# EAGLE schematic STM32 output card (EAGLE 9.5.1)
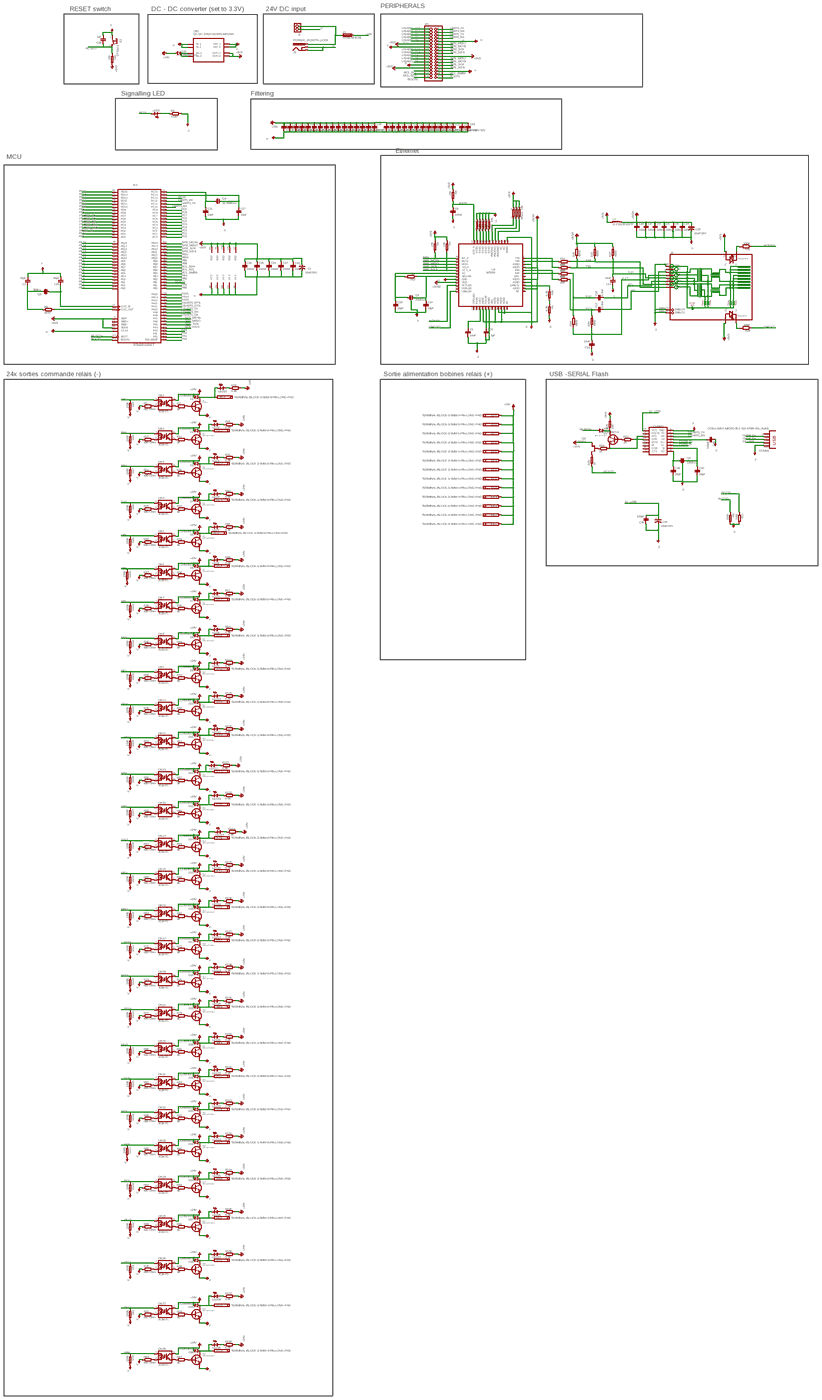
[diagram p0: schematic, sheet 1, overview]
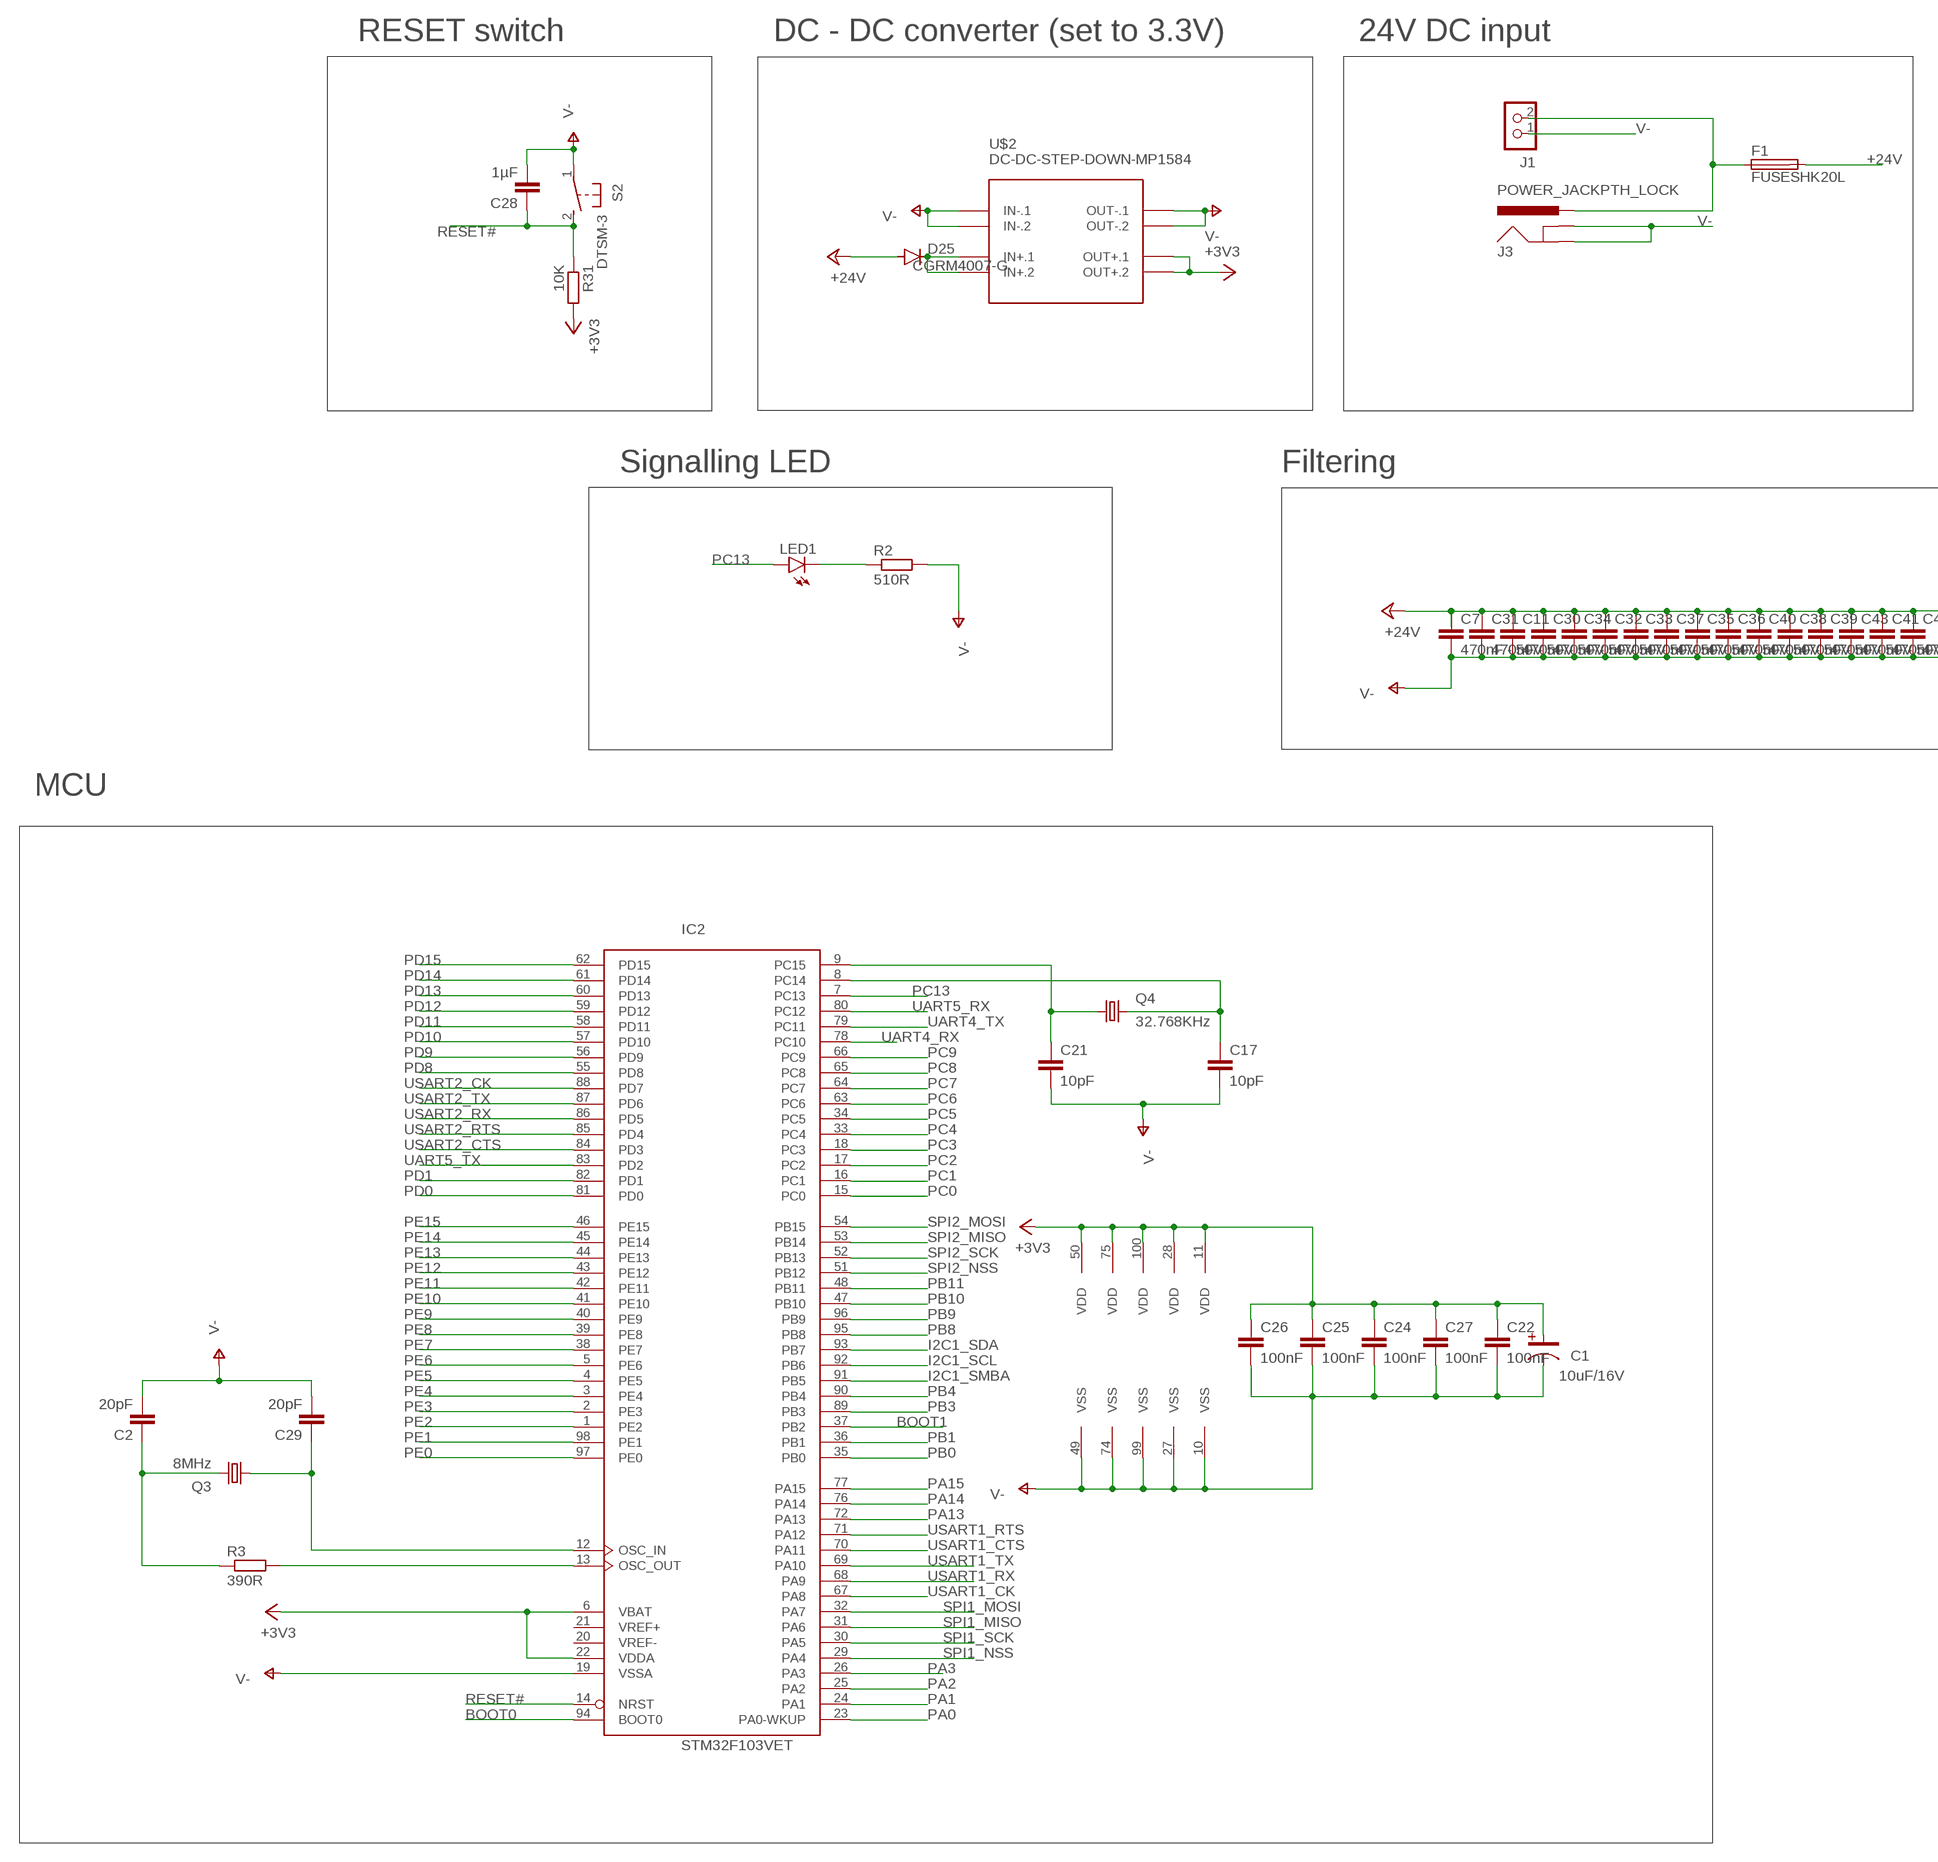
[diagram p1: schematic, sheet 1, part 1 of 6]
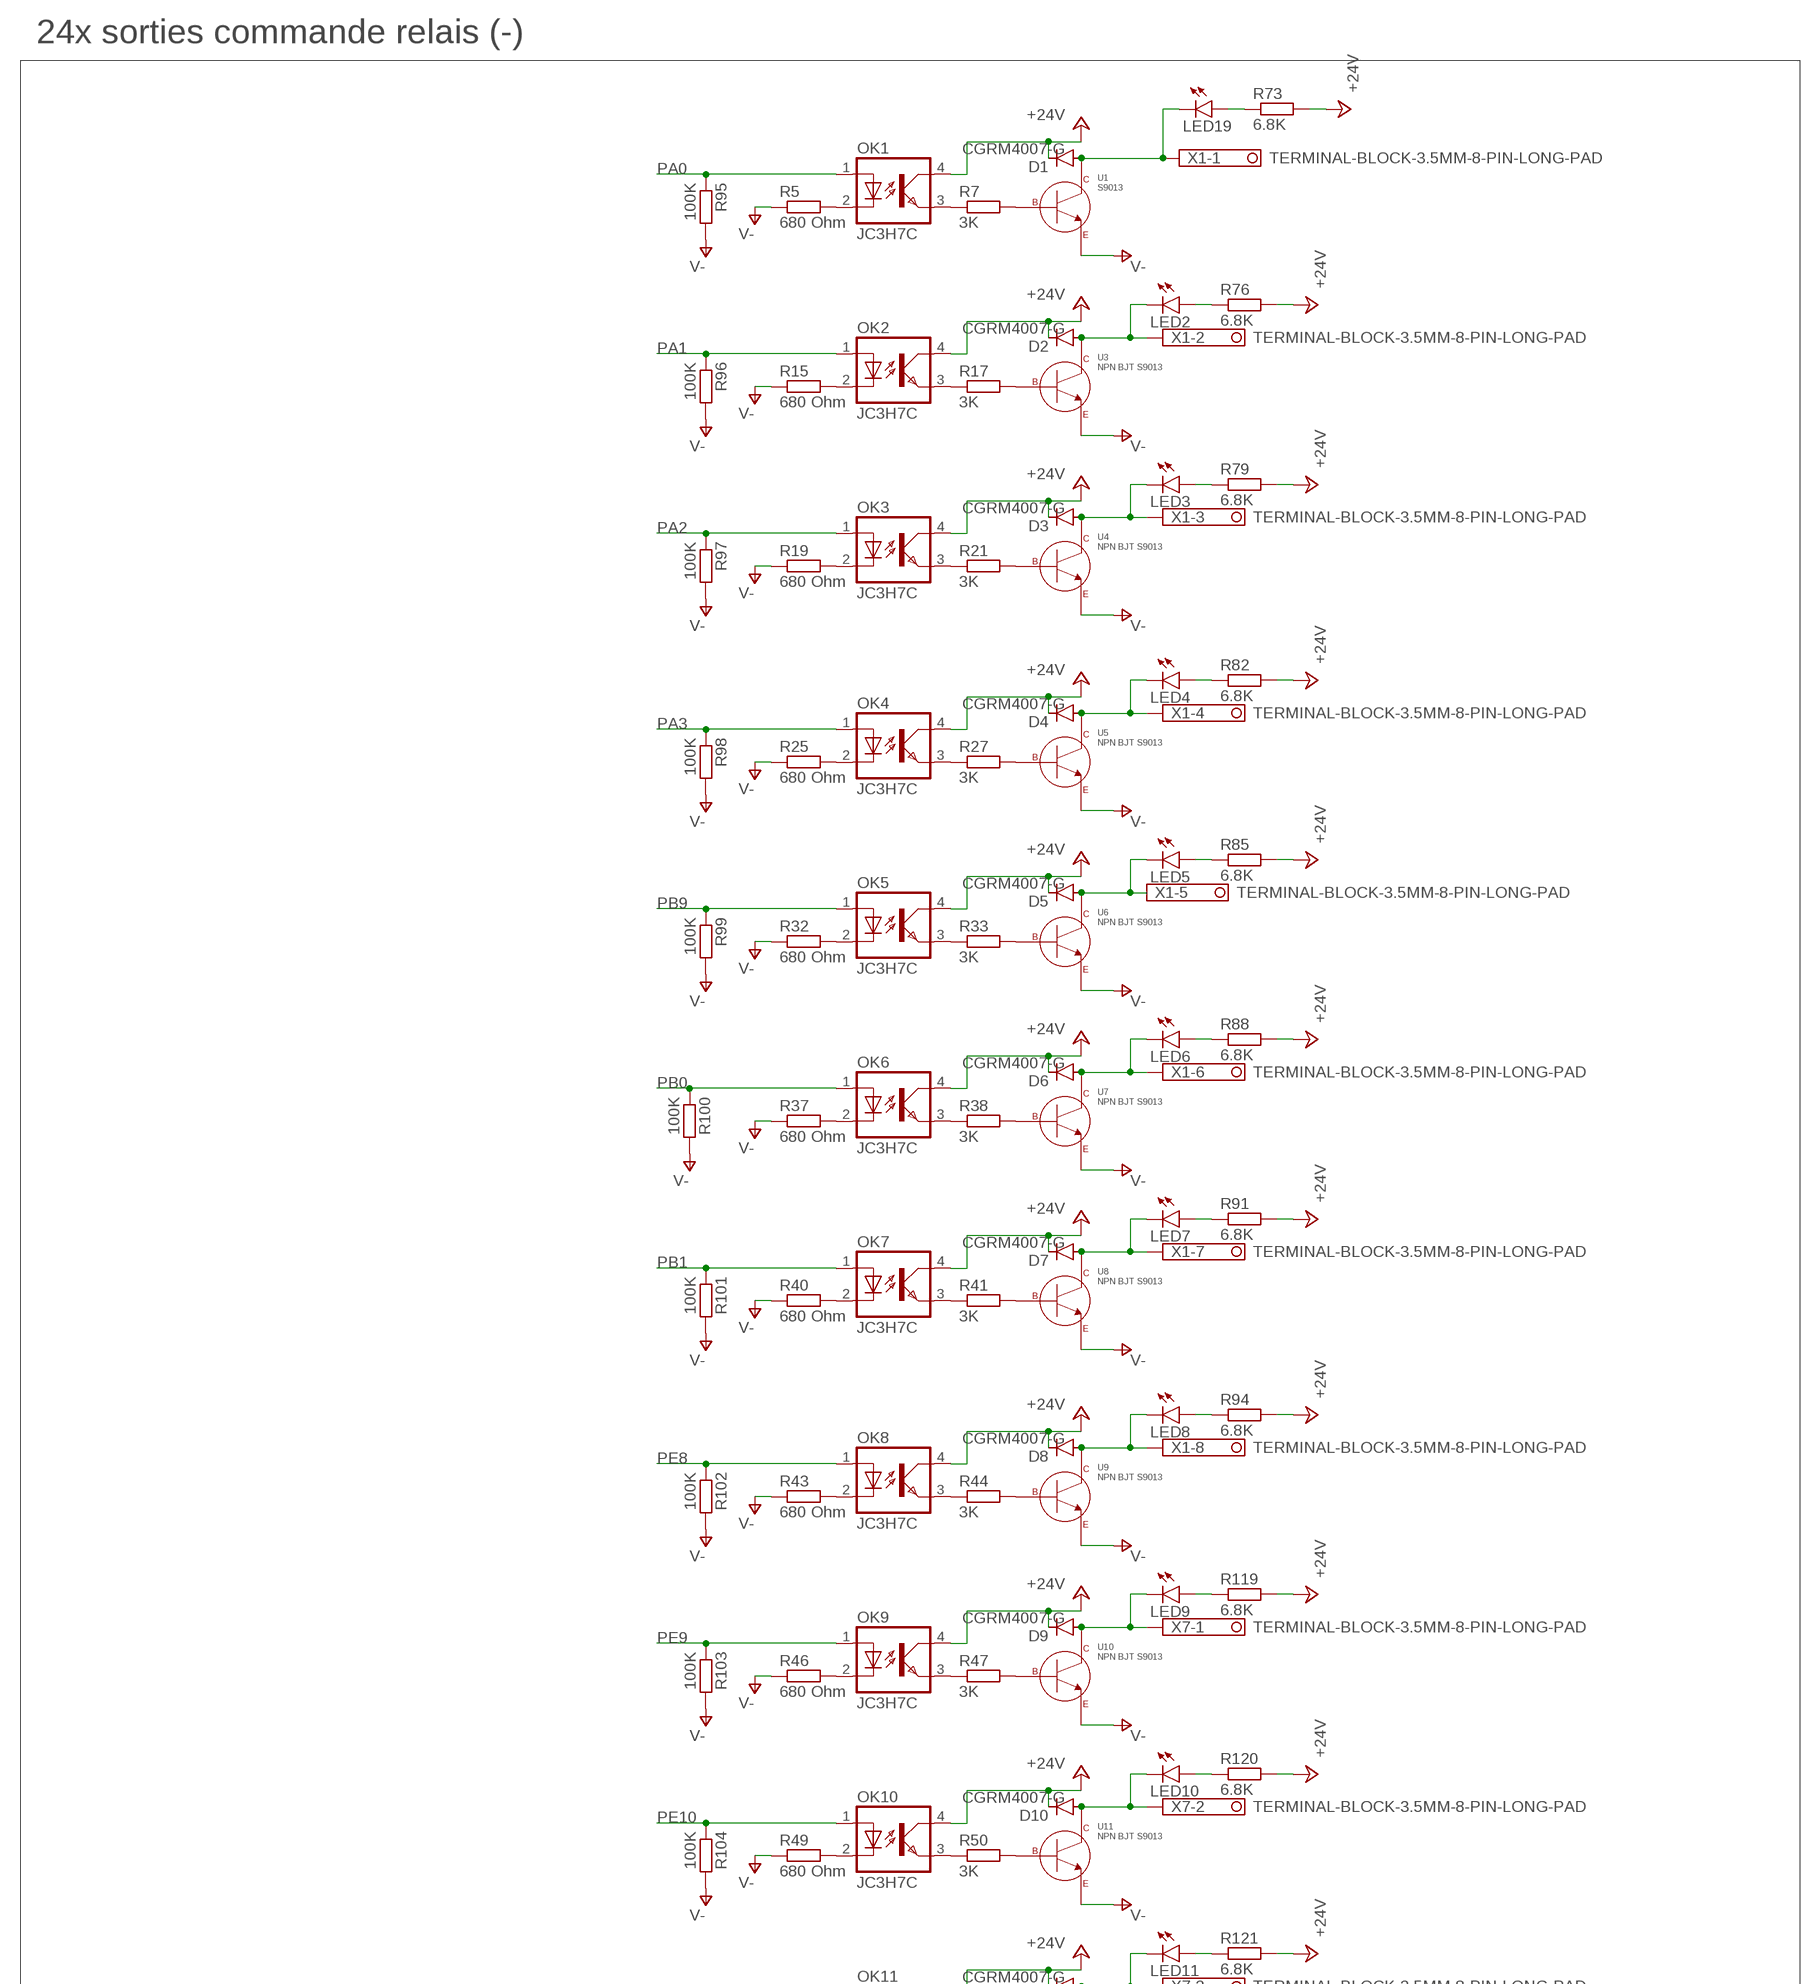
[diagram p2: schematic, sheet 1, part 2 of 6]
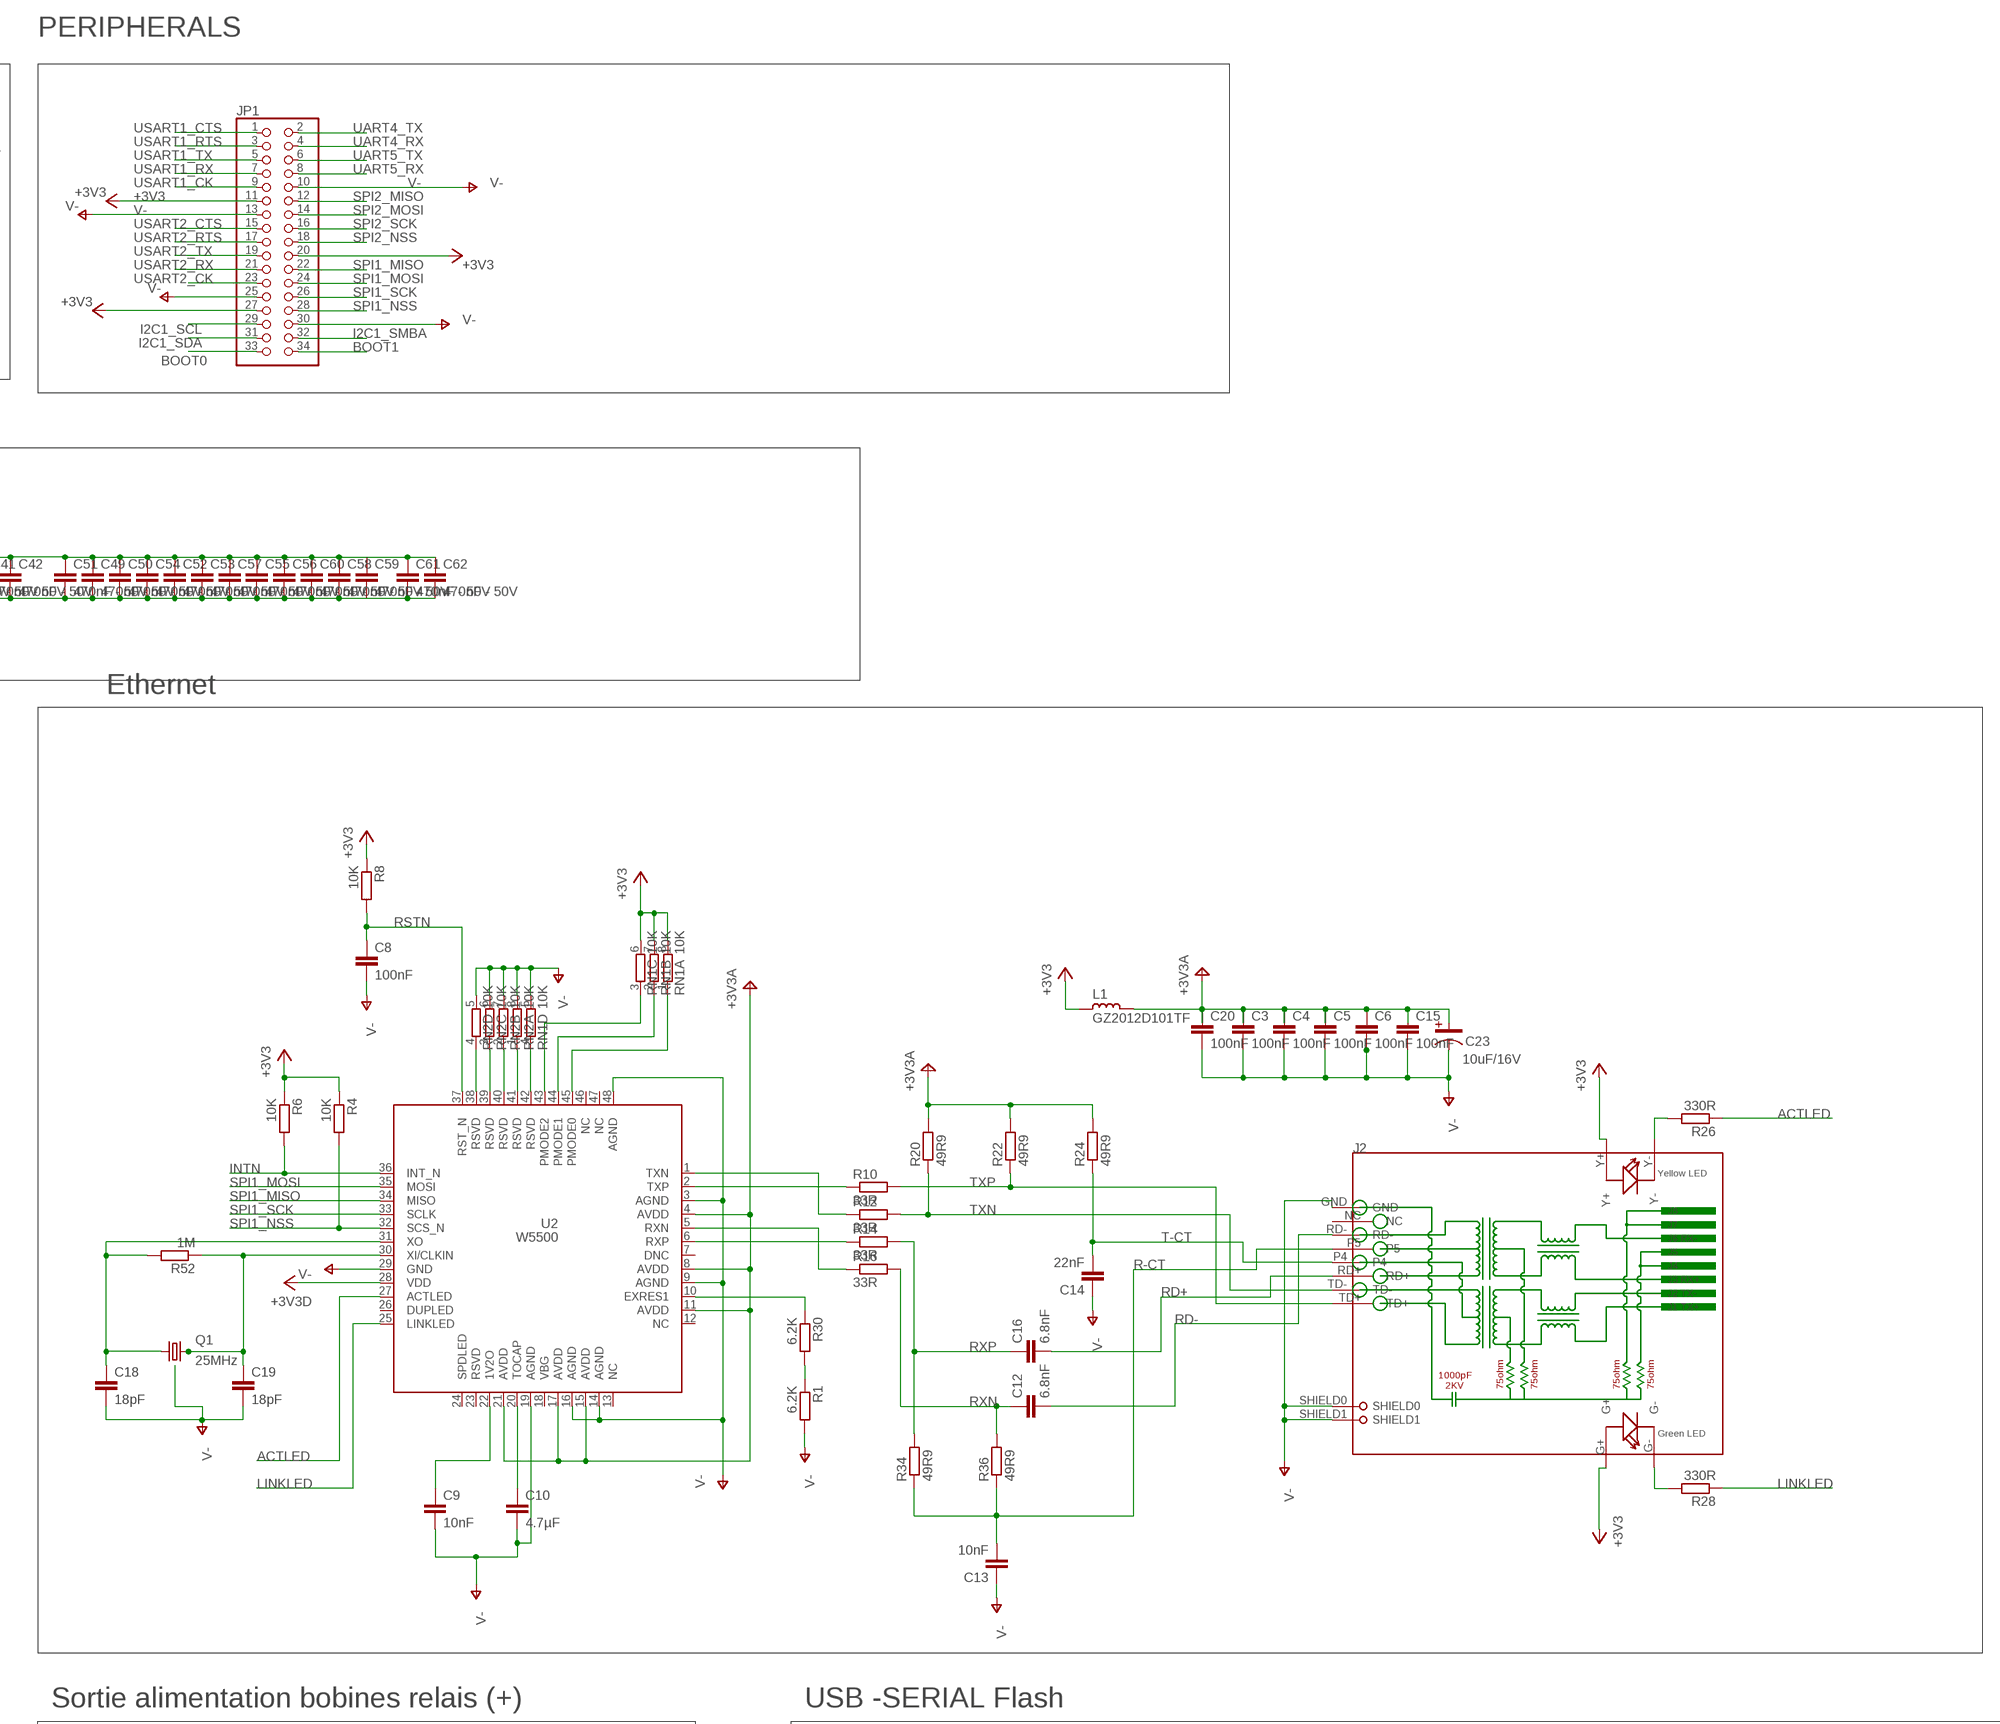
[diagram p3: schematic, sheet 1, part 3 of 6]
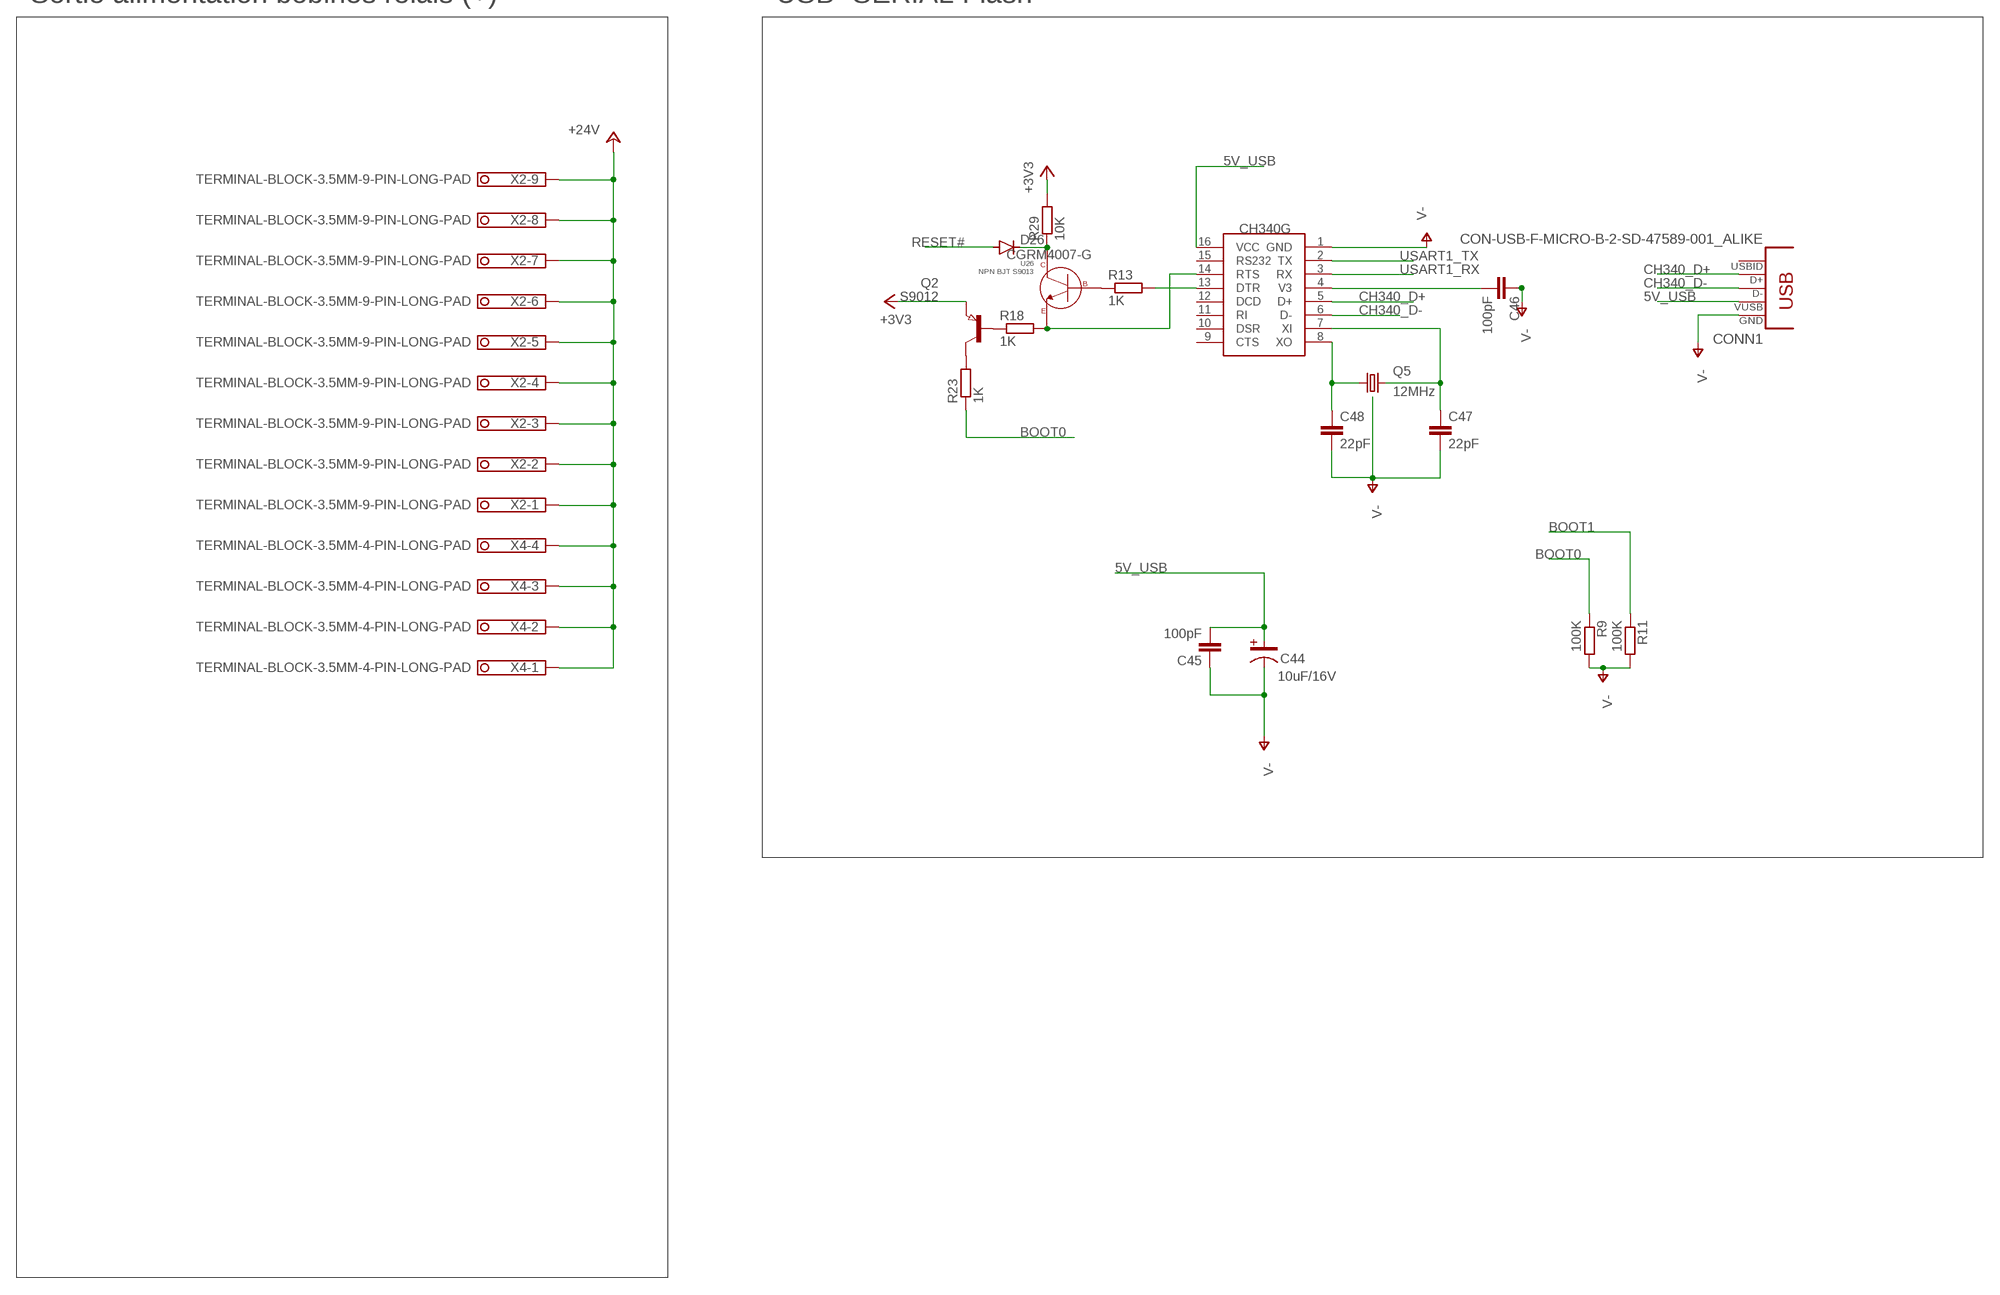
[diagram p4: schematic, sheet 1, part 4 of 6]
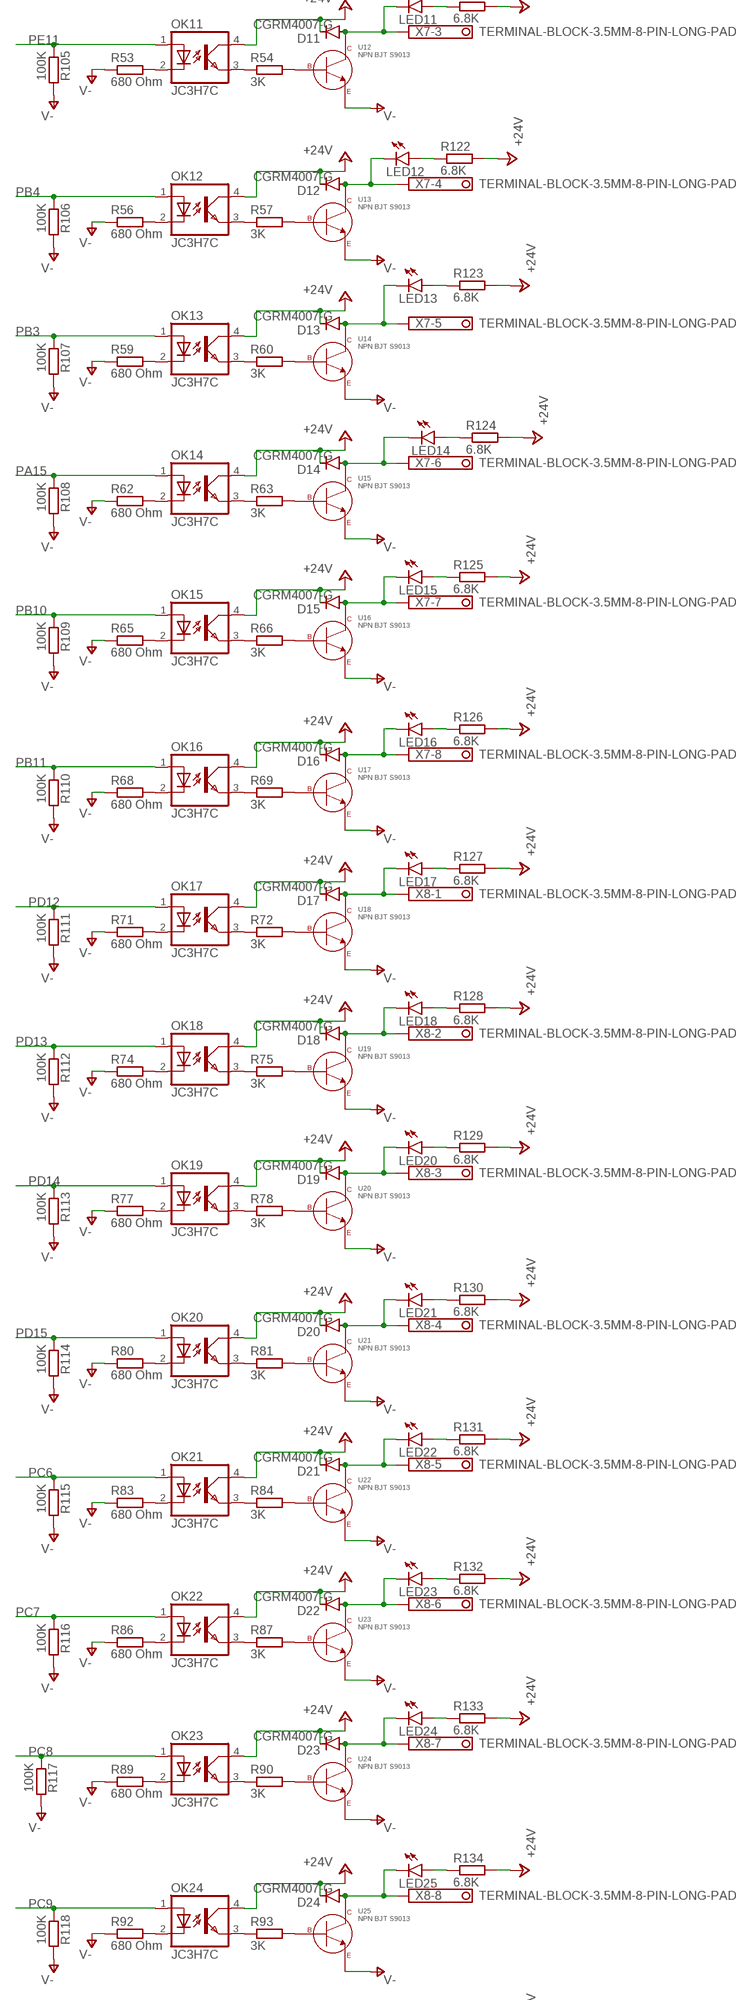
[diagram p5: schematic, sheet 1, part 5 of 6]
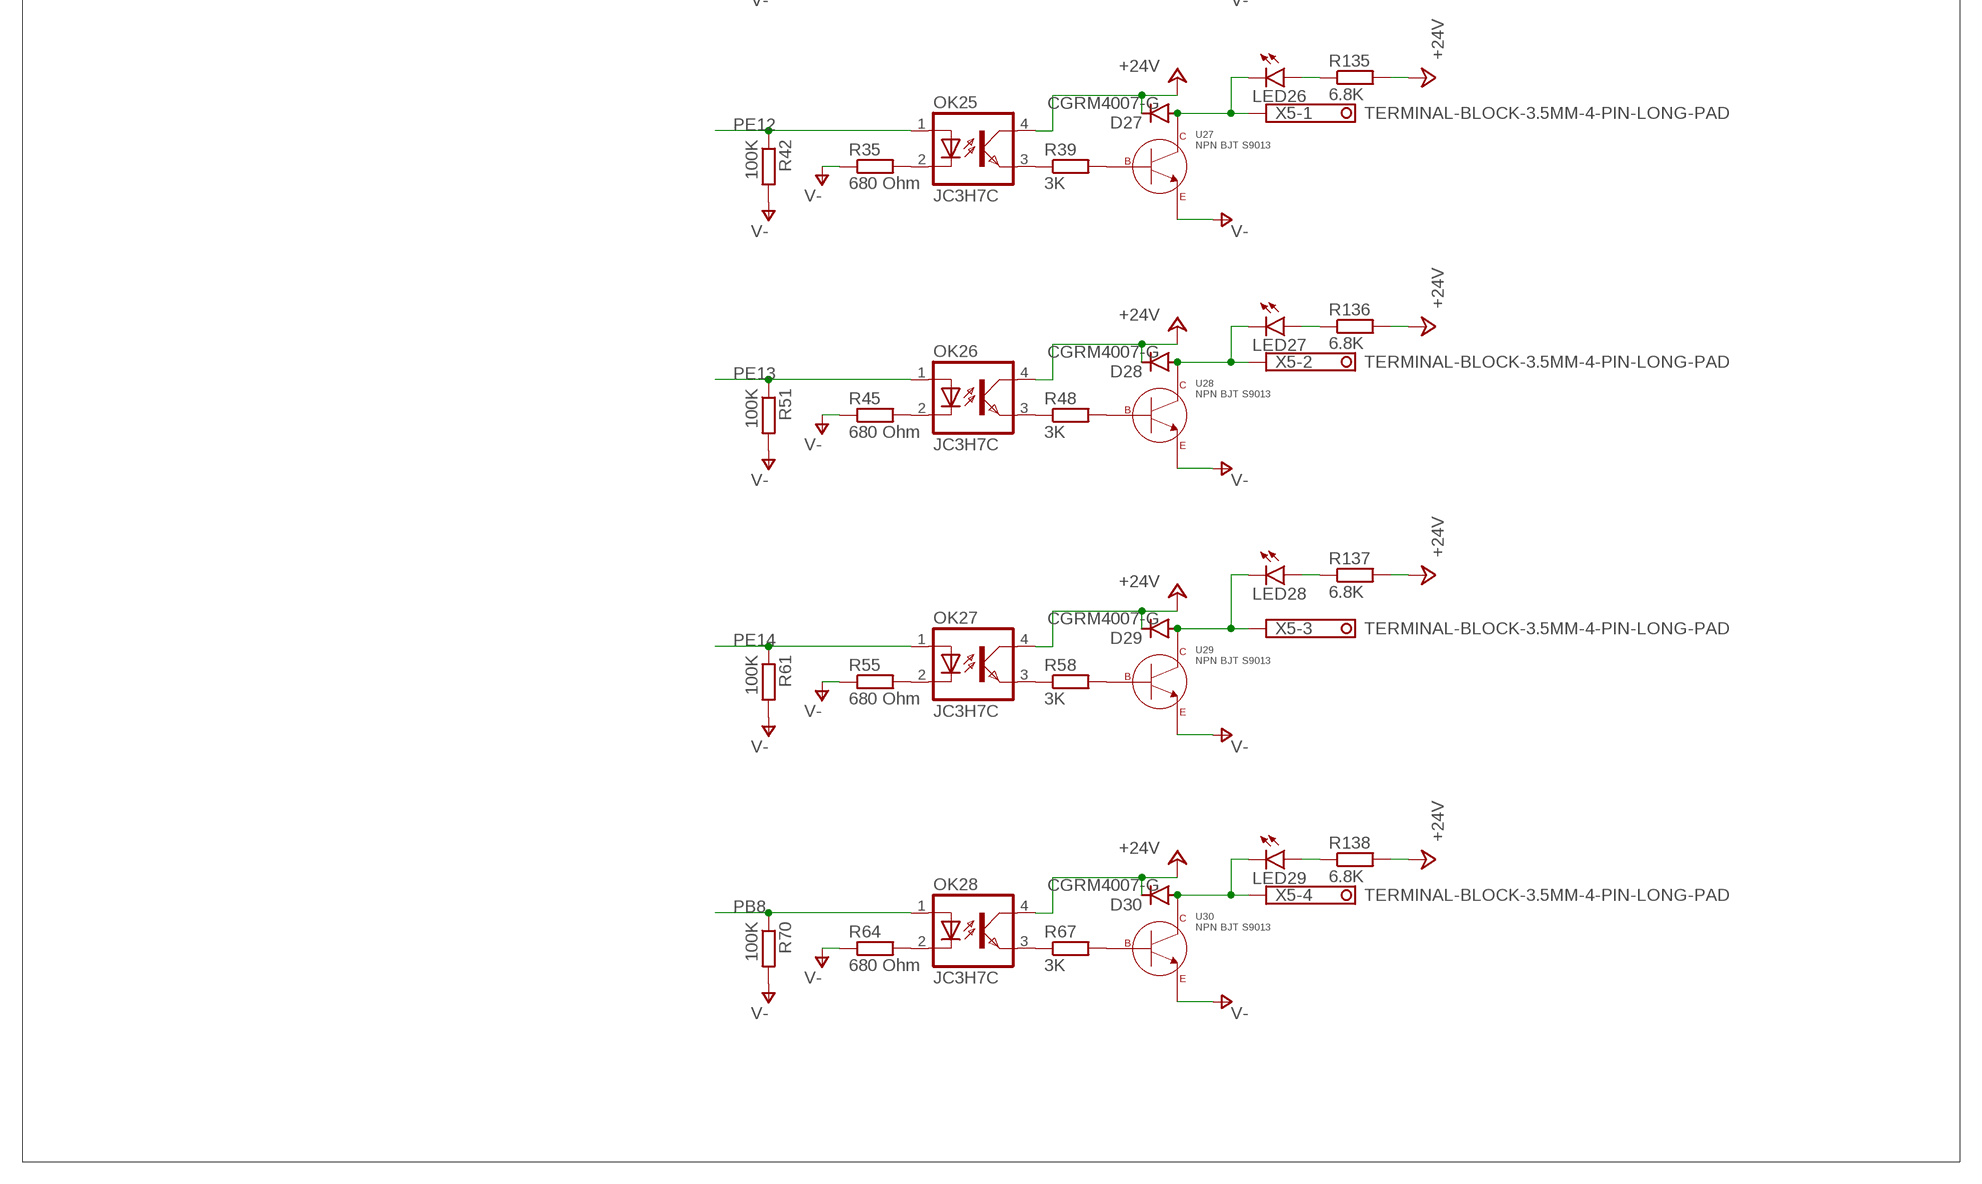
[diagram p6: schematic, sheet 1, part 6 of 6]

## Parts
C1  10uF/16V  C-3216(TANTAL)  [C-3216(TANTAL)]
C2  20pF  C-EUC0402  [C0402]
C3  100nF  C-EUC0402  [C0402]
C4  100nF  C-EUC0402  [C0402]
C5  100nF  C-EUC0402  [C0402]
C6  100nF  C-EUC0402  [C0402]
C7  470nF - 50V  C-EUC0805  [C0805]
C8  100nF  C-EUC0402  [C0402]
C9  10nF  C-EUC0402  [C0402]
C10  4.7µF  C-EUC0402  [C0402]
C11  470nF - 50V  C-EUC0805  [C0805]
C12  6.8nF  C-EUC0402  [C0402]
C13  10nF  C-EUC0402  [C0402]
C14  22nF  C-EUC0402  [C0402]
C15  100nF  C-EUC0402  [C0402]
C16  6.8nF  C-EUC0402  [C0402]
C17  10pF  C-EUC0402  [C0402]
C18  18pF  C-EUC0402  [C0402]
C19  18pF  C-EUC0402  [C0402]
C20  100nF  C-EUC0402  [C0402]
C21  10pF  C-EUC0402  [C0402]
C22  100nF  C-EUC0402  [C0402]
C23  10uF/16V  C-3216(TANTAL)  [C-3216(TANTAL)]
C24  100nF  C-EUC0402  [C0402]
C25  100nF  C-EUC0402  [C0402]
C26  100nF  C-EUC0402  [C0402]
C27  100nF  C-EUC0402  [C0402]
C28  1µF  C-EUC0402  [C0402]
C29  20pF  C-EUC0402  [C0402]
C30  470nF - 50V  C-EUC0805  [C0805]
C31  470nF - 50V  C-EUC0805  [C0805]
C32  470nF - 50V  C-EUC0805  [C0805]
C33  470nF - 50V  C-EUC0805  [C0805]
C34  470nF - 50V  C-EUC0805  [C0805]
C35  470nF - 50V  C-EUC0805  [C0805]
C36  470nF - 50V  C-EUC0805  [C0805]
C37  470nF - 50V  C-EUC0805  [C0805]
C38  470nF - 50V  C-EUC0805  [C0805]
C39  470nF - 50V  C-EUC0805  [C0805]
C40  470nF - 50V  C-EUC0805  [C0805]
C41  470nF - 50V  C-EUC0805  [C0805]
C42  470nF - 50V  C-EUC0805  [C0805]
C43  470nF - 50V  C-EUC0805  [C0805]
C44  10uF/16V  C-3216(TANTAL)  [C-3216(TANTAL)]
C45  100pF  C-EUC0402  [C0402]
C46  100pF  C-EUC0402  [C0402]
C47  22pF  C-EUC0402  [C0402]
C48  22pF  C-EUC0402  [C0402]
C49  470nF - 50V  C-EUC0805  [C0805]
C50  470nF - 50V  C-EUC0805  [C0805]
C51  470nF - 50V  C-EUC0805  [C0805]
C52  470nF - 50V  C-EUC0805  [C0805]
C53  470nF - 50V  C-EUC0805  [C0805]
C54  470nF - 50V  C-EUC0805  [C0805]
C55  470nF - 50V  C-EUC0805  [C0805]
C56  470nF - 50V  C-EUC0805  [C0805]
C57  470nF - 50V  C-EUC0805  [C0805]
C58  470nF - 50V  C-EUC0805  [C0805]
C59  470nF - 50V  C-EUC0805  [C0805]
C60  470nF - 50V  C-EUC0805  [C0805]
C61  470nF - 50V  C-EUC0805  [C0805]
C62  470nF - 50V  C-EUC0805  [C0805]
CONN1  CON-USB-F-MICRO-B-2-SD-47589-001_ALIKE  [CON_USB_MICRO-B-3]
D1  CGRM4007-G  [SOD-123_MINI-SMA]
D2  CGRM4007-G  [SOD-123_MINI-SMA]
D3  CGRM4007-G  [SOD-123_MINI-SMA]
D4  CGRM4007-G  [SOD-123_MINI-SMA]
D5  CGRM4007-G  [SOD-123_MINI-SMA]
D6  CGRM4007-G  [SOD-123_MINI-SMA]
D7  CGRM4007-G  [SOD-123_MINI-SMA]
D8  CGRM4007-G  [SOD-123_MINI-SMA]
D9  CGRM4007-G  [SOD-123_MINI-SMA]
D10  CGRM4007-G  [SOD-123_MINI-SMA]
D11  CGRM4007-G  [SOD-123_MINI-SMA]
D12  CGRM4007-G  [SOD-123_MINI-SMA]
D13  CGRM4007-G  [SOD-123_MINI-SMA]
D14  CGRM4007-G  [SOD-123_MINI-SMA]
D15  CGRM4007-G  [SOD-123_MINI-SMA]
D16  CGRM4007-G  [SOD-123_MINI-SMA]
D17  CGRM4007-G  [SOD-123_MINI-SMA]
D18  CGRM4007-G  [SOD-123_MINI-SMA]
D19  CGRM4007-G  [SOD-123_MINI-SMA]
D20  CGRM4007-G  [SOD-123_MINI-SMA]
D21  CGRM4007-G  [SOD-123_MINI-SMA]
D22  CGRM4007-G  [SOD-123_MINI-SMA]
D23  CGRM4007-G  [SOD-123_MINI-SMA]
D24  CGRM4007-G  [SOD-123_MINI-SMA]
D25  CGRM4007-G  [SOD-123_MINI-SMA]
D26  CGRM4007-G  [SOD-123_MINI-SMA]
D27  CGRM4007-G  [SOD-123_MINI-SMA]
D28  CGRM4007-G  [SOD-123_MINI-SMA]
D29  CGRM4007-G  [SOD-123_MINI-SMA]
D30  CGRM4007-G  [SOD-123_MINI-SMA]
F1  FUSESHK20L  [SHK20L]
IC2  STM32F103VET  [LQFP100]
J1  CON_TERMINAL_BLOCK_02-5MM  [TERMINAL_BLOCK_2P_5]
J2  RJ45-HR911105A-HR911105A  [RJ45]
J3  POWER_JACKPTH_LOCK  [POWER_JACK_PTH_LOCK]
JP1  PINHD-2X17  [2X17]
L1  GZ2012D101TF  L_0805  [L0805]
LED1  LEDCHIP-LED0603  [CHIP-LED0603]
LED2  LEDSML0603  [SML0603]
LED3  LEDSML0603  [SML0603]
LED4  LEDSML0603  [SML0603]
LED5  LEDSML0603  [SML0603]
LED6  LEDSML0603  [SML0603]
LED7  LEDSML0603  [SML0603]
LED8  LEDSML0603  [SML0603]
LED9  LEDSML0603  [SML0603]
LED10  LEDSML0603  [SML0603]
LED11  LEDSML0603  [SML0603]
LED12  LEDSML0603  [SML0603]
LED13  LEDSML0603  [SML0603]
LED14  LEDSML0603  [SML0603]
LED15  LEDSML0603  [SML0603]
LED16  LEDSML0603  [SML0603]
LED17  LEDSML0603  [SML0603]
LED18  LEDSML0603  [SML0603]
LED19  LEDSML0603  [SML0603]
LED20  LEDSML0603  [SML0603]
LED21  LEDSML0603  [SML0603]
LED22  LEDSML0603  [SML0603]
LED23  LEDSML0603  [SML0603]
LED24  LEDSML0603  [SML0603]
LED25  LEDSML0603  [SML0603]
LED26  LEDSML0603  [SML0603]
LED27  LEDSML0603  [SML0603]
LED28  LEDSML0603  [SML0603]
LED29  LEDSML0603  [SML0603]
OK1  JC3H7C  [MINI-FLAT-4]
OK2  JC3H7C  [MINI-FLAT-4]
OK3  JC3H7C  [MINI-FLAT-4]
OK4  JC3H7C  [MINI-FLAT-4]
OK5  JC3H7C  [MINI-FLAT-4]
OK6  JC3H7C  [MINI-FLAT-4]
OK7  JC3H7C  [MINI-FLAT-4]
OK8  JC3H7C  [MINI-FLAT-4]
OK9  JC3H7C  [MINI-FLAT-4]
OK10  JC3H7C  [MINI-FLAT-4]
OK11  JC3H7C  [MINI-FLAT-4]
OK12  JC3H7C  [MINI-FLAT-4]
OK13  JC3H7C  [MINI-FLAT-4]
OK14  JC3H7C  [MINI-FLAT-4]
OK15  JC3H7C  [MINI-FLAT-4]
OK16  JC3H7C  [MINI-FLAT-4]
OK17  JC3H7C  [MINI-FLAT-4]
OK18  JC3H7C  [MINI-FLAT-4]
OK19  JC3H7C  [MINI-FLAT-4]
OK20  JC3H7C  [MINI-FLAT-4]
OK21  JC3H7C  [MINI-FLAT-4]
OK22  JC3H7C  [MINI-FLAT-4]
OK23  JC3H7C  [MINI-FLAT-4]
OK24  JC3H7C  [MINI-FLAT-4]
OK25  JC3H7C  [MINI-FLAT-4]
OK26  JC3H7C  [MINI-FLAT-4]
OK27  JC3H7C  [MINI-FLAT-4]
OK28  JC3H7C  [MINI-FLAT-4]
Q1  25MHz  KX-7  [3.2X2.5_KX-7]
Q2  S9012  PNP-TRANSISTOR_SOT23  [SOT23]
Q3  8MHz  KX-9B  [5.0X3.2_2]
Q4  32.768KHz  KX-327-NHT  [3.2X1.5]
Q5  12MHz  KX-7  [3.2X2.5_KX-7]
R1  6.2K  R-EU_R0603  [R0603]
R2  510R  R-EU_R0402  [R0402]
R3  390R  R-EU_R0603  [R0603]
R4  10K  R-EU_R0402  [R0402]
R5  680 Ohm  R-EU_R0402  [R0402]
R6  10K  R-EU_R0402  [R0402]
R7  3K  R-EU_R0805  [R0805]
R8  10K  R-EU_R0402  [R0402]
R9  100K  R-EU_R0402  [R0402]
R10  33R  R-EU_R0805  [R0805]
R11  100K  R-EU_R0402  [R0402]
R12  33R  R-EU_R0805  [R0805]
R13  1K  R-EU_R0402  [R0402]
R14  33R  R-EU_R0805  [R0805]
R15  680 Ohm  R-EU_R0402  [R0402]
R16  33R  R-EU_R0805  [R0805]
R17  3K  R-EU_R0805  [R0805]
R18  1K  R-EU_R0402  [R0402]
R19  680 Ohm  R-EU_R0402  [R0402]
R20  49R9  R-EU_R0805  [R0805]
R21  3K  R-EU_R0805  [R0805]
R22  49R9  R-EU_R0805  [R0805]
R23  1K  R-EU_R0402  [R0402]
R24  49R9  R-EU_R0805  [R0805]
R25  680 Ohm  R-EU_R0402  [R0402]
R26  330R  R-EU_R0402  [R0402]
R27  3K  R-EU_R0805  [R0805]
R28  330R  R-EU_R0402  [R0402]
R29  10K  R-EU_R0402  [R0402]
R30  6.2K  R-EU_R0603  [R0603]
R31  10K  R-EU_R0402  [R0402]
R32  680 Ohm  R-EU_R0402  [R0402]
R33  3K  R-EU_R0805  [R0805]
R34  49R9  R-EU_R0805  [R0805]
R35  680 Ohm  R-EU_R0402  [R0402]
R36  49R9  R-EU_R0805  [R0805]
R37  680 Ohm  R-EU_R0402  [R0402]
R38  3K  R-EU_R0805  [R0805]
R39  3K  R-EU_R0805  [R0805]
R40  680 Ohm  R-EU_R0402  [R0402]
R41  3K  R-EU_R0805  [R0805]
R42  100K  R-EU_R0402  [R0402]
R43  680 Ohm  R-EU_R0402  [R0402]
R44  3K  R-EU_R0805  [R0805]
R45  680 Ohm  R-EU_R0402  [R0402]
R46  680 Ohm  R-EU_R0402  [R0402]
R47  3K  R-EU_R0805  [R0805]
R48  3K  R-EU_R0805  [R0805]
R49  680 Ohm  R-EU_R0402  [R0402]
R50  3K  R-EU_R0805  [R0805]
R51  100K  R-EU_R0402  [R0402]
R52  1M  R-EU_R0402  [R0402]
R53  680 Ohm  R-EU_R0402  [R0402]
R54  3K  R-EU_R0805  [R0805]
R55  680 Ohm  R-EU_R0402  [R0402]
R56  680 Ohm  R-EU_R0402  [R0402]
R57  3K  R-EU_R0805  [R0805]
R58  3K  R-EU_R0805  [R0805]
R59  680 Ohm  R-EU_R0402  [R0402]
R60  3K  R-EU_R0805  [R0805]
R61  100K  R-EU_R0402  [R0402]
R62  680 Ohm  R-EU_R0402  [R0402]
R63  3K  R-EU_R0805  [R0805]
R64  680 Ohm  R-EU_R0402  [R0402]
R65  680 Ohm  R-EU_R0402  [R0402]
R66  3K  R-EU_R0805  [R0805]
R67  3K  R-EU_R0805  [R0805]
R68  680 Ohm  R-EU_R0402  [R0402]
R69  3K  R-EU_R0805  [R0805]
R70  100K  R-EU_R0402  [R0402]
R71  680 Ohm  R-EU_R0402  [R0402]
R72  3K  R-EU_R0805  [R0805]
R73  6.8K  R-EU_R0402  [R0402]
R74  680 Ohm  R-EU_R0402  [R0402]
R75  3K  R-EU_R0805  [R0805]
R76  6.8K  R-EU_R0402  [R0402]
R77  680 Ohm  R-EU_R0402  [R0402]
R78  3K  R-EU_R0805  [R0805]
R79  6.8K  R-EU_R0402  [R0402]
R80  680 Ohm  R-EU_R0402  [R0402]
R81  3K  R-EU_R0805  [R0805]
R82  6.8K  R-EU_R0402  [R0402]
R83  680 Ohm  R-EU_R0402  [R0402]
R84  3K  R-EU_R0805  [R0805]
R85  6.8K  R-EU_R0402  [R0402]
R86  680 Ohm  R-EU_R0402  [R0402]
R87  3K  R-EU_R0805  [R0805]
R88  6.8K  R-EU_R0402  [R0402]
R89  680 Ohm  R-EU_R0402  [R0402]
R90  3K  R-EU_R0805  [R0805]
R91  6.8K  R-EU_R0402  [R0402]
R92  680 Ohm  R-EU_R0402  [R0402]
R93  3K  R-EU_R0805  [R0805]
R94  6.8K  R-EU_R0402  [R0402]
R95  100K  R-EU_R0402  [R0402]
R96  100K  R-EU_R0402  [R0402]
R97  100K  R-EU_R0402  [R0402]
R98  100K  R-EU_R0402  [R0402]
R99  100K  R-EU_R0402  [R0402]
R100  100K  R-EU_R0402  [R0402]
R101  100K  R-EU_R0402  [R0402]
R102  100K  R-EU_R0402  [R0402]
R103  100K  R-EU_R0402  [R0402]
R104  100K  R-EU_R0402  [R0402]
R105  100K  R-EU_R0402  [R0402]
R106  100K  R-EU_R0402  [R0402]
R107  100K  R-EU_R0402  [R0402]
R108  100K  R-EU_R0402  [R0402]
R109  100K  R-EU_R0402  [R0402]
R110  100K  R-EU_R0402  [R0402]
R111  100K  R-EU_R0402  [R0402]
R112  100K  R-EU_R0402  [R0402]
R113  100K  R-EU_R0402  [R0402]
R114  100K  R-EU_R0402  [R0402]
R115  100K  R-EU_R0402  [R0402]
R116  100K  R-EU_R0402  [R0402]
R117  100K  R-EU_R0402  [R0402]
R118  100K  R-EU_R0402  [R0402]
R119  6.8K  R-EU_R0402  [R0402]
R120  6.8K  R-EU_R0402  [R0402]
R121  6.8K  R-EU_R0402  [R0402]
R122  6.8K  R-EU_R0402  [R0402]
R123  6.8K  R-EU_R0402  [R0402]
R124  6.8K  R-EU_R0402  [R0402]
R125  6.8K  R-EU_R0402  [R0402]
R126  6.8K  R-EU_R0402  [R0402]
R127  6.8K  R-EU_R0402  [R0402]
R128  6.8K  R-EU_R0402  [R0402]
R129  6.8K  R-EU_R0402  [R0402]
R130  6.8K  R-EU_R0402  [R0402]
R131  6.8K  R-EU_R0402  [R0402]
R132  6.8K  R-EU_R0402  [R0402]
R133  6.8K  R-EU_R0402  [R0402]
R134  6.8K  R-EU_R0402  [R0402]
R135  6.8K  R-EU_R0402  [R0402]
R136  6.8K  R-EU_R0402  [R0402]
R137  6.8K  R-EU_R0402  [R0402]
R138  6.8K  R-EU_R0402  [R0402]
RN1  10K  4R-N0402ARV341  [4X0402ARV341]
RN2  10K  4R-N0402ARV341  [4X0402ARV341]
S2  DTSM-3  [DTSM-3]
U1  S9013  NPN_BJTMMBT3904_SOT-23-3  [SOT-23-3]
U2  W5500  [W5500]
U3  NPN BJT S9013  NPN_BJTMMBT3904_SOT-23-3  [SOT-23-3]
U4  NPN BJT S9013  NPN_BJTMMBT3904_SOT-23-3  [SOT-23-3]
U5  NPN BJT S9013  NPN_BJTMMBT3904_SOT-23-3  [SOT-23-3]
U6  NPN BJT S9013  NPN_BJTMMBT3904_SOT-23-3  [SOT-23-3]
U7  NPN BJT S9013  NPN_BJTMMBT3904_SOT-23-3  [SOT-23-3]
U8  NPN BJT S9013  NPN_BJTMMBT3904_SOT-23-3  [SOT-23-3]
U9  NPN BJT S9013  NPN_BJTMMBT3904_SOT-23-3  [SOT-23-3]
U10  NPN BJT S9013  NPN_BJTMMBT3904_SOT-23-3  [SOT-23-3]
U11  NPN BJT S9013  NPN_BJTMMBT3904_SOT-23-3  [SOT-23-3]
U12  NPN BJT S9013  NPN_BJTMMBT3904_SOT-23-3  [SOT-23-3]
U13  NPN BJT S9013  NPN_BJTMMBT3904_SOT-23-3  [SOT-23-3]
U14  NPN BJT S9013  NPN_BJTMMBT3904_SOT-23-3  [SOT-23-3]
U15  NPN BJT S9013  NPN_BJTMMBT3904_SOT-23-3  [SOT-23-3]
U16  NPN BJT S9013  NPN_BJTMMBT3904_SOT-23-3  [SOT-23-3]
U17  NPN BJT S9013  NPN_BJTMMBT3904_SOT-23-3  [SOT-23-3]
U18  NPN BJT S9013  NPN_BJTMMBT3904_SOT-23-3  [SOT-23-3]
U19  NPN BJT S9013  NPN_BJTMMBT3904_SOT-23-3  [SOT-23-3]
U20  NPN BJT S9013  NPN_BJTMMBT3904_SOT-23-3  [SOT-23-3]
U21  NPN BJT S9013  NPN_BJTMMBT3904_SOT-23-3  [SOT-23-3]
U22  NPN BJT S9013  NPN_BJTMMBT3904_SOT-23-3  [SOT-23-3]
U23  NPN BJT S9013  NPN_BJTMMBT3904_SOT-23-3  [SOT-23-3]
U24  NPN BJT S9013  NPN_BJTMMBT3904_SOT-23-3  [SOT-23-3]
U25  NPN BJT S9013  NPN_BJTMMBT3904_SOT-23-3  [SOT-23-3]
U26  NPN BJT S9013  NPN_BJTMMBT3904_SOT-23-3  [SOT-23-3]
U27  NPN BJT S9013  NPN_BJTMMBT3904_SOT-23-3  [SOT-23-3]
U28  NPN BJT S9013  NPN_BJTMMBT3904_SOT-23-3  [SOT-23-3]
U29  NPN BJT S9013  NPN_BJTMMBT3904_SOT-23-3  [SOT-23-3]
U30  NPN BJT S9013  NPN_BJTMMBT3904_SOT-23-3  [SOT-23-3]
U$1  CH340G  [SOIC16]
U$2  DC-DC-STEP-DOWN-MP1584  [DC-DC-STEP-DOWN-MP1584]
X1  TERMINAL-BLOCK-3.5MM-8-PIN-LONG-PAD  [TERMINAL-BLOCK-8-PIN-3.5MM-LONG-PAD]
X2  TERMINAL-BLOCK-3.5MM-9-PIN-LONG-PAD  [TERMINAL-BLOCK-9-PIN-3.5MM-LONG-PAD]
X4  TERMINAL-BLOCK-3.5MM-4-PIN-LONG-PAD  [TERMINAL-BLOCK-4-PIN-3.5MM-LONG-PAD]
X5  TERMINAL-BLOCK-3.5MM-4-PIN-LONG-PAD  [TERMINAL-BLOCK-4-PIN-3.5MM-LONG-PAD]
X7  TERMINAL-BLOCK-3.5MM-8-PIN-LONG-PAD  [TERMINAL-BLOCK-8-PIN-3.5MM-LONG-PAD]
X8  TERMINAL-BLOCK-3.5MM-8-PIN-LONG-PAD  [TERMINAL-BLOCK-8-PIN-3.5MM-LONG-PAD]

## Nets
5V_USB: C44.1 C45.2 CONN1.P1(VUSB) U$1.16(VCC)
+3V3: C1.1 C22.1 C24.1 C25.1 C26.1 C27.1 IC2.6(VBAT) IC2.11(VDD) IC2.22(VDDA) IC2.28(VDD) IC2.50(VDD) IC2.75(VDD) IC2.100(VDD) J2.G+ J2.Y+ JP1.11 JP1.20 JP1.27 L1.2 Q2.2(E) R4.1 R6.1 R8.1 R29.2 R31.2 RN1.6 RN1.7 RN1.8 U2.28(VDD) U$2.OUT+.1 U$2.OUT+.2 ; supply symbol labelled +3V3D
+3V3A: C3.1 C4.1 C5.1 C6.1 C15.1 C20.1 C23.1 L1.1 R20.2 R22.2 R24.2 U2.4(AVDD) U2.8(AVDD) U2.11(AVDD) U2.15(AVDD) U2.17(AVDD) U2.21(AVDD)
+24V: C7.1 C11.1 C30.1 C31.1 C32.1 C33.1 C34.1 C35.1 C36.1 C37.1 C38.1 C39.1 C40.1 C41.1 C42.1 C43.1 C49.1 C50.1 C51.1 C52.1 C53.1 C54.1 C55.1 C56.1 C57.1 C58.1 C59.1 C60.1 C61.1 C62.1 D1.C D2.C D3.C D4.C D5.C D6.C D7.C D8.C D9.C D10.C D11.C D12.C D13.C D14.C D15.C D16.C D17.C D18.C D19.C D20.C D21.C D22.C D23.C D24.C D25.A D27.C D28.C D29.C D30.C F1.2A OK1.4(COL) OK2.4(COL) OK3.4(COL) OK4.4(COL) OK5.4(COL) OK6.4(COL) OK7.4(COL) OK8.4(COL) OK9.4(COL) OK10.4(COL) OK11.4(COL) OK12.4(COL) OK13.4(COL) OK14.4(COL) OK15.4(COL) OK16.4(COL) OK17.4(COL) OK18.4(COL) OK19.4(COL) OK20.4(COL) OK21.4(COL) OK22.4(COL) OK23.4(COL) OK24.4(COL) OK25.4(COL) OK26.4(COL) OK27.4(COL) OK28.4(COL) R73.2 R76.2 R79.2 R82.2 R85.2 R88.2 R91.2 R94.2 R119.2 R120.2 R121.2 R122.2 R123.2 R124.2 R125.2 R126.2 R127.2 R128.2 R129.2 R130.2 R131.2 R132.2 R133.2 R134.2 R135.2 R136.2 R137.2 R138.2 X2.1 X2.2 X2.3 X2.4 X2.5 X2.6 X2.7 X2.8 X2.9 X4.1 X4.2 X4.3 X4.4
ACTLED: R26.1 U2.27(ACTLED)
BOOT0: IC2.94(BOOT0) JP1.33 R9.1 R23.1
BOOT1: IC2.37(PB2) JP1.34 R11.1
CH340_D+: CONN1.P3(D+) U$1.5(D+)
CH340_D-: CONN1.P2(D-) U$1.6(D-)
I2C1_SCL: IC2.92(PB6) JP1.29
I2C1_SDA: IC2.93(PB7) JP1.31
I2C1_SMBA: IC2.91(PB5) JP1.32
INTN: R6.2 U2.36(INT_N)
LINKLED: R28.1 U2.25(LINKLED)
N$1: OK1.2(C) R5.2
N$2: LED1.C R2.1
N$3: C2.1 Q3.2 R3.1
N$4: C17.1 IC2.8(PC14) Q4.2
N$5: D25.C U$2.IN+.1 U$2.IN+.2
N$6: C21.1 IC2.9(PC15) Q4.1
N$7: C29.1 IC2.12(OSC_IN) Q3.1
N$8: IC2.13(OSC_OUT) R3.2
N$9: OK1.3(EMIT) R7.1
N$10: R7.2 U1.P$1(BASE)
N$11: LED2.A R76.1
N$12: LED19.A R73.1
N$13: OK25.3(EMIT) R39.1
N$14: OK2.3(EMIT) R17.1
N$15: R17.2 U3.P$1(BASE)
N$17: OK2.2(C) R15.2
N$18: RN2.4 U2.38(RSVD)
N$19: R18.2 U26.P$2(EMITTER) U$1.14(RTS)
N$20: OK3.3(EMIT) R21.1
N$21: R21.2 U4.P$1(BASE)
N$23: OK3.2(C) R19.2
N$24: F1.1A J1.2 J3.PWR
N$25: OK4.3(EMIT) R27.1
N$26: R27.2 U5.P$1(BASE)
N$28: OK4.2(C) R25.2
N$29: C47.1 Q5.3 U$1.7(XI)
N$30: OK5.3(EMIT) R33.1
N$31: R33.2 U6.P$1(BASE)
N$33: OK5.2(C) R32.2
N$34: C46.2 U$1.4(V3)
N$35: OK6.3(EMIT) R38.1
N$36: R38.2 U7.P$1(BASE)
N$38: OK6.2(C) R37.2
N$39: R13.2 U$1.13(DTR)
N$40: OK7.3(EMIT) R41.1
N$41: R41.2 U8.P$1(BASE)
N$43: OK7.2(C) R40.2
N$44: C48.1 Q5.1 U$1.8(XO)
N$45: OK8.3(EMIT) R44.1
N$46: R44.2 U9.P$1(BASE)
N$48: OK8.2(C) R43.2
N$49: R13.1 U26.P$1(BASE)
N$50: OK9.3(EMIT) R47.1
N$51: R47.2 U10.P$1(BASE)
N$53: OK9.2(C) R46.2
N$54: RN2.3 U2.39(RSVD)
N$55: Q2.1(B) R18.1
N$56: RN2.2 U2.40(RSVD)
N$57: OK10.3(EMIT) R50.1
N$58: RN2.1 U2.41(RSVD)
N$59: R50.2 U11.P$1(BASE)
N$60: RN1.4 U2.42(RSVD)
N$62: OK10.2(C) R49.2
N$63: Q2.3(C) R23.2
N$64: OK11.3(EMIT) R54.1
N$65: R54.2 U12.P$1(BASE)
N$67: OK11.2(C) R53.2
N$68: D26.C R29.1 U26.P$3(COLLECTOR)
N$69: OK12.3(EMIT) R57.1
N$70: R57.2 U13.P$1(BASE)
N$72: OK12.2(C) R56.2
N$73: R39.2 U27.P$1(BASE)
N$74: OK13.3(EMIT) R60.1
N$75: R60.2 U14.P$1(BASE)
N$77: OK13.2(C) R59.2
N$79: OK14.3(EMIT) R63.1
N$80: R63.2 U15.P$1(BASE)
N$82: OK14.2(C) R62.2
N$83: J2.Y- R26.2
N$84: OK25.2(C) R35.2
N$85: OK15.3(EMIT) R66.1
N$86: R66.2 U16.P$1(BASE)
N$88: OK15.2(C) R65.2
N$89: OK26.3(EMIT) R48.1
N$90: OK16.3(EMIT) R69.1
N$91: R69.2 U17.P$1(BASE)
N$93: OK16.2(C) R68.2
N$94: R48.2 U28.P$1(BASE)
N$95: OK17.3(EMIT) R72.1
N$96: J2.G- R28.2
N$97: R72.2 U18.P$1(BASE)
N$98: R1.1 R30.2
N$100: OK17.2(C) R71.2
N$102: OK18.3(EMIT) R75.1
N$103: R75.2 U19.P$1(BASE)
N$105: OK18.2(C) R74.2
N$106: OK26.2(C) R45.2
N$107: OK19.3(EMIT) R78.1
N$108: R78.2 U20.P$1(BASE)
N$110: OK19.2(C) R77.2
N$111: OK27.3(EMIT) R58.1
N$112: OK20.3(EMIT) R81.1
N$113: R81.2 U21.P$1(BASE)
N$115: OK20.2(C) R80.2
N$116: R58.2 U29.P$1(BASE)
N$117: OK21.3(EMIT) R84.1
N$118: R84.2 U22.P$1(BASE)
N$120: OK21.2(C) R83.2
N$122: OK22.3(EMIT) R87.1
N$123: R87.2 U23.P$1(BASE)
N$125: OK22.2(C) R86.2
N$126: OK27.2(C) R55.2
N$127: OK23.3(EMIT) R90.1
N$128: R90.2 U24.P$1(BASE)
N$130: OK23.2(C) R89.2
N$131: OK28.3(EMIT) R67.1
N$132: OK24.3(EMIT) R93.1
N$133: R93.2 U25.P$1(BASE)
N$135: OK24.2(C) R92.2
N$136: R67.2 U30.P$1(BASE)
N$138: OK28.2(C) R64.2
N$139: D1.A LED19.C U1.P$3(COLLECTOR) X1.1
N$140: D2.A LED2.C U3.P$3(COLLECTOR) X1.2
N$141: LED3.A R79.1
N$142: D3.A LED3.C U4.P$3(COLLECTOR) X1.3
N$143: LED4.A R82.1
N$144: D4.A LED4.C U5.P$3(COLLECTOR) X1.4
N$145: LED5.A R85.1
N$146: D5.A LED5.C U6.P$3(COLLECTOR) X1.5
N$147: LED6.A R88.1
N$148: D6.A LED6.C U7.P$3(COLLECTOR) X1.6
N$149: LED7.A R91.1
N$150: D7.A LED7.C U8.P$3(COLLECTOR) X1.7
N$151: LED8.A R94.1
N$152: D8.A LED8.C U9.P$3(COLLECTOR) X1.8
N$153: LED9.A R119.1
N$154: D9.A LED9.C U10.P$3(COLLECTOR) X7.1
N$155: LED10.A R120.1
N$156: D10.A LED10.C U11.P$3(COLLECTOR) X7.2
N$157: LED11.A R121.1
N$158: D11.A LED11.C U12.P$3(COLLECTOR) X7.3
N$159: LED12.A R122.1
N$160: D12.A LED12.C U13.P$3(COLLECTOR) X7.4
N$161: LED13.A R123.1
N$162: D13.A LED13.C U14.P$3(COLLECTOR) X7.5
N$163: LED14.A R124.1
N$164: D14.A LED14.C U15.P$3(COLLECTOR) X7.6
N$165: LED15.A R125.1
N$166: D15.A LED15.C U16.P$3(COLLECTOR) X7.7
N$167: LED16.A R126.1
N$168: D16.A LED16.C U17.P$3(COLLECTOR) X7.8
N$169: LED17.A R127.1
N$170: D17.A LED17.C U18.P$3(COLLECTOR) X8.1
N$171: LED18.A R128.1
N$172: D18.A LED18.C U19.P$3(COLLECTOR) X8.2
N$173: LED20.A R129.1
N$174: D19.A LED20.C U20.P$3(COLLECTOR) X8.3
N$175: LED21.A R130.1
N$176: D20.A LED21.C U21.P$3(COLLECTOR) X8.4
N$177: LED22.A R131.1
N$178: D21.A LED22.C U22.P$3(COLLECTOR) X8.5
N$179: LED23.A R132.1
N$180: D22.A LED23.C U23.P$3(COLLECTOR) X8.6
N$181: LED24.A R133.1
N$182: D23.A LED24.C U24.P$3(COLLECTOR) X8.7
N$183: LED25.A R134.1
N$184: D24.A LED25.C U25.P$3(COLLECTOR) X8.8
N$185: LED26.A R135.1
N$186: D27.A LED26.C U27.P$3(COLLECTOR) X5.1
N$187: LED27.A R136.1
N$188: D28.A LED27.C U28.P$3(COLLECTOR) X5.2
N$189: LED28.A R137.1
N$190: D29.A LED28.C U29.P$3(COLLECTOR) X5.3
N$191: LED29.A R138.1
N$192: D30.A LED29.C U30.P$3(COLLECTOR) X5.4
N$199: RN1.3 U2.43(PMODE2)
N$200: RN1.2 U2.44(PMODE1)
N$201: RN1.1 U2.45(PMODE0)
N$202: C10.1 U2.20(TOCAP)
N$203: C9.1 U2.22(1V2O)
N$204: R30.1 U2.10(EXRES1)
N$222: C18.1 Q1.1 R52.2 U2.31(XO)
N$223: R14.1 U2.6(RXP)
N$224: R16.1 U2.5(RXN)
N$243: R10.1 U2.2(TXP)
N$256: R12.1 U2.1(TXN)
N$258: C19.1 Q1.3 R52.1 U2.30(XI/CLKIN)
PA0: IC2.23(PA0-WKUP) OK1.1(A) R95.1
PA1: IC2.24(PA1) OK2.1(A) R96.1
PA2: IC2.25(PA2) OK3.1(A) R97.1
PA3: IC2.26(PA3) OK4.1(A) R98.1
PA13: IC2.72(PA13)
PA14: IC2.76(PA14)
PA15: IC2.77(PA15) OK14.1(A) R108.1
PB0: IC2.35(PB0) OK6.1(A) R100.1
PB1: IC2.36(PB1) OK7.1(A) R101.1
PB3: IC2.89(PB3) OK13.1(A) R107.1
PB4: IC2.90(PB4) OK12.1(A) R106.1
PB8: IC2.95(PB8) OK28.1(A) R70.1
PB9: IC2.96(PB9) OK5.1(A) R99.1
PB10: IC2.47(PB10) OK15.1(A) R109.1
PB11: IC2.48(PB11) OK16.1(A) R110.1
PC0: IC2.15(PC0)
PC1: IC2.16(PC1)
PC2: IC2.17(PC2)
PC3: IC2.18(PC3)
PC4: IC2.33(PC4)
PC5: IC2.34(PC5)
PC6: IC2.63(PC6) OK21.1(A) R115.1
PC7: IC2.64(PC7) OK22.1(A) R116.1
PC8: IC2.65(PC8) OK23.1(A) R117.1
PC9: IC2.66(PC9) OK24.1(A) R118.1
PC13: IC2.7(PC13) LED1.A
PD0: IC2.81(PD0)
PD1: IC2.82(PD1)
PD8: IC2.55(PD8)
PD9: IC2.56(PD9)
PD10: IC2.57(PD10)
PD11: IC2.58(PD11)
PD12: IC2.59(PD12) OK17.1(A) R111.1
PD13: IC2.60(PD13) OK18.1(A) R112.1
PD14: IC2.61(PD14) OK19.1(A) R113.1
PD15: IC2.62(PD15) OK20.1(A) R114.1
PE0: IC2.97(PE0)
PE1: IC2.98(PE1)
PE2: IC2.1(PE2)
PE3: IC2.2(PE3)
PE4: IC2.3(PE4)
PE5: IC2.4(PE5)
PE6: IC2.5(PE6)
PE7: IC2.38(PE7)
PE8: IC2.39(PE8) OK8.1(A) R102.1
PE9: IC2.40(PE9) OK9.1(A) R103.1
PE10: IC2.41(PE10) OK10.1(A) R104.1
PE11: IC2.42(PE11) OK11.1(A) R105.1
PE12: IC2.43(PE12) OK25.1(A) R42.1
PE13: IC2.44(PE13) OK26.1(A) R51.1
PE14: IC2.45(PE14) OK27.1(A) R61.1
PE15: IC2.46(PE15)
R-CT: C13.2 J2.P5 R34.1 R36.1
RD+: C16.2 J2.RD+
RD-: C12.2 J2.RD-
RESET#: C28.1 D26.A IC2.14(NRST) R31.1 S2.2
RSTN: C8.1 R8.2 U2.37(RST_N)
RXN: C12.1 R16.2 R36.2
RXP: C16.1 R14.2 R34.2
SPI1_MISO: IC2.31(PA6) JP1.22 U2.34(MISO)
SPI1_MOSI: IC2.32(PA7) JP1.24 U2.35(MOSI)
SPI1_NSS: IC2.29(PA4) JP1.28 R4.2 U2.32(SCS_N)
SPI1_SCK: IC2.30(PA5) JP1.26 U2.33(SCLK)
SPI2_MISO: IC2.53(PB14) JP1.12
SPI2_MOSI: IC2.54(PB15) JP1.14
SPI2_NSS: IC2.51(PB12) JP1.18
SPI2_SCK: IC2.52(PB13) JP1.16
T-CT: C14.2 J2.P4 R24.1
TXN: J2.TD- R12.2 R20.1
TXP: J2.TD+ R10.2 R22.1
UART4_RX: IC2.78(PC10) JP1.4
UART4_TX: IC2.79(PC11) JP1.2
UART5_RX: IC2.80(PC12) JP1.8
UART5_TX: IC2.83(PD2) JP1.6
USART1_CK: IC2.67(PA8) JP1.9
USART1_CTS: IC2.70(PA11) JP1.1
USART1_RTS: IC2.71(PA12) JP1.3
USART1_RX: IC2.68(PA9) JP1.7 U$1.3(RX)
USART1_TX: IC2.69(PA10) JP1.5 U$1.2(TX)
USART2_CK: IC2.88(PD7) JP1.23
USART2_CTS: IC2.84(PD3) JP1.15
USART2_RTS: IC2.85(PD4) JP1.17
USART2_RX: IC2.86(PD5) JP1.21
USART2_TX: IC2.87(PD6) JP1.19
V-: C1.2 C2.2 C3.2 C4.2 C5.2 C6.2 C7.2 C8.2 C9.2 C10.2 C11.2 C13.1 C14.1 C15.2 C17.2 C18.2 C19.2 C20.2 C21.2 C22.2 C23.2 C24.2 C25.2 C26.2 C27.2 C28.2 C29.2 C30.2 C31.2 C32.2 C33.2 C34.2 C35.2 C36.2 C37.2 C38.2 C39.2 C40.2 C41.2 C42.2 C43.2 C44.2 C45.1 C46.1 C47.2 C48.2 C49.2 C50.2 C51.2 C52.2 C53.2 C54.2 C55.2 C56.2 C57.2 C58.2 C59.2 C60.2 C61.2 C62.2 CONN1.P5(GND) IC2.10(VSS) IC2.19(VSSA) IC2.27(VSS) IC2.49(VSS) IC2.74(VSS) IC2.99(VSS) J1.1 J2.GND J2.SHIELD0 J2.SHIELD1 J3.GND J3.GNDBREAK JP1.10 JP1.13 JP1.25 JP1.30 Q1.2(GND) Q1.4(GND) Q5.2(GND) Q5.4(GND) R1.2 R2.2 R5.1 R9.2 R11.2 R15.1 R19.1 R25.1 R32.1 R35.1 R37.1 R40.1 R42.2 R43.1 R45.1 R46.1 R49.1 R51.2 R53.1 R55.1 R56.1 R59.1 R61.2 R62.1 R64.1 R65.1 R68.1 R70.2 R71.1 R74.1 R77.1 R80.1 R83.1 R86.1 R89.1 R92.1 R95.2 R96.2 R97.2 R98.2 R99.2 R100.2 R101.2 R102.2 R103.2 R104.2 R105.2 R106.2 R107.2 R108.2 R109.2 R110.2 R111.2 R112.2 R113.2 R114.2 R115.2 R116.2 R117.2 R118.2 RN1.5 RN2.5 RN2.6 RN2.7 RN2.8 S2.1 U1.P$2(EMITTER) U2.3(AGND) U2.9(AGND) U2.14(AGND) U2.16(AGND) U2.19(AGND) U2.29(GND) U2.48(AGND) U3.P$2(EMITTER) U4.P$2(EMITTER) U5.P$2(EMITTER) U6.P$2(EMITTER) U7.P$2(EMITTER) U8.P$2(EMITTER) U9.P$2(EMITTER) U10.P$2(EMITTER) U11.P$2(EMITTER) U12.P$2(EMITTER) U13.P$2(EMITTER) U14.P$2(EMITTER) U15.P$2(EMITTER) U16.P$2(EMITTER) U17.P$2(EMITTER) U18.P$2(EMITTER) U19.P$2(EMITTER) U20.P$2(EMITTER) U21.P$2(EMITTER) U22.P$2(EMITTER) U23.P$2(EMITTER) U24.P$2(EMITTER) U25.P$2(EMITTER) U27.P$2(EMITTER) U28.P$2(EMITTER) U29.P$2(EMITTER) U30.P$2(EMITTER) U$1.1(GND) U$2.IN-.1 U$2.IN-.2 U$2.OUT-.1 U$2.OUT-.2
Unconnected: CONN1.B1 CONN1.B2 CONN1.B3 CONN1.B4 CONN1.B5 CONN1.B6 CONN1.B7 CONN1.B8 CONN1.P4(USBID) J2.NC U2.7(DNC) U2.12(NC) U2.13(NC) U2.18(VBG) U2.23(RSVD) U2.24(SPDLED) U2.26(DUPLED) U2.46(NC) U2.47(NC) U$1.9(CTS) U$1.10(DSR) U$1.11(RI) U$1.12(DCD) U$1.15(RS232)

## Notes on the sheet
- PERIPHERALS
- RESET switch | DC - DC converter (set to 3.3V) | 24V DC input
- Signalling LED | Filtering
- Ethernet
- MCU
- 24x sorties commande relais (-) | Sortie alimentation bobines relais (+) | USB -SERIAL Flash

## Power pins joined to a net without a drawn wire
VREF+: IC2.21(VREF+)
VREF-: IC2.20(VREF-)

## Library data of the parts
C1 C23 C44 = CAP:C-3216(TANTAL)
C2-C22 C24-C43 C45-C62 = rcl:C-EU: CAPACITOR, European symbol; SPICEPREFIX: C
CONN1 = dp_devices.v6:CON-USB-F-MICRO-B-2: Micro USB based on molex SD-47589-001
D1-D30 = diode:CGRM400*-G: Molded plasitc,JEDEC SOD-123/Mini SMA Source: Comchip CGRM4001-G.pdf
F1 = fuse:FUSE: Fuse; OC_FARNELL: unknown; OC_NEWARK: unknown
IC2 = micro-stm:STM32F103V*T: ARM 32-bit Cortex™-M3 CPU 72 MHz maximum frequency 64 to 1028 Kbytes of Flash memory 20 to 96 kbytes of SRAM 80 GPIOs 2.0 to 3.6 V application supply
J1 = dp_devices.v6:CON_TERMINAL_BLOCK_02: 2 poles wire to board terminal block
J2 = Connector:RJ45-HR911105A
J3 = SparkFun-Connectors:POWER_JACK: Power Jack Connector This is the standard 5.5mm barrel jack for power. The PTH is the most common, proven, reliable, footprint. The Slot footprint only works if the mill layer is transmitted to the PCB fab house so be warned. Here are the connectors we sell at SparkFun: DC Barrel Power Jack/Connector <https://www.sparkfun.com/products/119> (PRT-00119) DC Barrel Power Jack/Connector (SMD) <https://www.sparkfun.com/products/12748> (PRT-12748) DC Barrel Jack Adapter - Breadboard Compatible <https://www.sparkfun.com/products/10811> (PRT-10811) It is used on this SparkFun product (and many, many others): SparkFun RedBoard - Programmed with Arduino <https://www.sparkfun.com/products/12757> (DEV-12757) Also, if you need a mating power supply or connector, please check these out: Wall Adapter Power Supply - 9VDC 650mA <https://www.sparkfun.com/products/298> (TOL-00298) DC Barrel Jack Adapter - Male <https://www.sparkfun.com/products/10287> (PRT-10287); PROD_ID: CONN-08197; SF_ID: PRT-00119
JP1 = pinhead:PINHD-2X17: PIN HEADER
L1 = rc-master-smd:L_: INDUCTOR
LED1-LED29 = led:LED: LED OSRAM: - CHIPLED LG R971, LG N971, LY N971, LG Q971, LY Q971, LO R971, LY R971 LH N974, LH R974 LS Q976, LO Q976, LY Q976 LO Q996 - Hyper CHIPLED LW Q18S LB Q993, LB Q99A, LB R99A - SideLED LS A670, LO A670, LY A670, LG A670, LP A670 LB A673, LV A673, LT A673, LW A673 LH A674 LY A675 LS A676, LA A676, LO A676, LY A676, LW A676 LS A679, LY A679, LG A679 - Hyper Micro SIDELED® LS Y876, LA Y876, LO Y876, LY Y876 LT Y87S - SmartLED LW L88C, LW L88S LB L89C, LB L89S, LG L890 LS L89K, LO L89K, LY L89K LS L896, LA L896, LO L896, LY L896 - TOPLED LS T670, LO T670, LY T670, LG T670, LP T670 LSG T670, LSP T670, LSY T670, LOP T670, LYG T670 LG T671, LOG T671, LSG T671 LB T673, LV T673, LT T673, LW T673 LH T674 LS T676, LA T676, LO T676, LY T676, LB T676, LH T676, LSB T676, LW T676 LB T67C, LV T67C, LT T67C, LS T67K, LO T67K, LY T67K, LW E67C LS E67B, LA E67B, LO E67B, LY E67B, LB E67C, LV E67C, LT E67C LW T67C LS T679, LY T679, LG T679 LS T770, LO T770, LY T770, LG T770, LP T770 LB T773, LV T773, LT T773, LW T773 LH T774 LS E675, LA E675, LY E675, LS T675 LS T776, LA T776, LO T776, LY T776, LB T776 LHGB T686 LT T68C, LB T68C - Hyper Mini TOPLED® LB M676 - Mini TOPLED Santana® LG M470 LS M47K, LO M47K, LY M47K Source: http://www.osram.convergy.de LUXEON: - LUMILED® LXK2-PW12-R00, LXK2-PW12-S00, LXK2-PW14-U00, LXK2-PW14-V00 LXK2-PM12-R00, LXK2-PM12-S00, LXK2-PM14-U00 LXK2-PE12-Q00, LXK2-PE12-R00, LXK2-PE12-S00, LXK2-PE14-T00, LXK2-PE14-U00 LXK2-PB12-K00, LXK2-PB12-L00, LXK2-PB12-M00, LXK2-PB14-N00, LXK2-PB14-P00, LXK2-PB14-Q00 LXK2-PR12-L00, LXK2-PR12-M00, LXK2-PR14-Q00, LXK2-PR14-R00 LXK2-PD12-Q00, LXK2-PD12-R00, LXK2-PD12-S00 LXK2-PH12-R00, LXK2-PH12-S00 LXK2-PL12-P00, LXK2-PL12-Q00, LXK2-PL12-R00 Source: www.luxeon.com KINGBRIGHT: KA-3528ASYC Source: www.kingbright.com
OK1-OK28 = JC3H7C:JC3H7C: JC3H7C optocoupler; LCSCPART#: C55287
Q1 Q5 = crystal-geyer_V1_0:KX: Quartz Crystals (MHz) SMD: KX - Serie Model Size l/w/h [mm] Frequency Range Frequency Stability Temp. Range [°C] Load Capacitance AECQ 200 availabel Datasheet KX-4 KX-5 KX-6 KX-7 KX-9A KX-9B KX-12A KX-12B KX-13 KX-20 KX-K KX-KS 1.6/1.2/0.3 2.0/1.6/0.45 2.5/2.0/0.55 3.2/2.5/0.8 5.0/3.2/1.0 5.0/3.2/1.1 6.0/3.5/1.1 6.0/3.5/1.0 7.0/5.0 /1.3 11.6/5.5/1.6 12.3/4.5/4.2 12.3/4.5/3.2 24.0 ~ 80.0 MHz 16.0 ~ 80.0 MHz 12.0 ~ 80.0 MHz 8.0 ~ 60.0 MHz 7,68 ~ 300,0 MHz 8,0 ~ 50,0 MHz 8,0 ~ 150,0 MHz 8,0 ~ 50,0 MHz 6,0 ~ 160,0 MHz 3,579 ~ 25,0 MHz 3,579 ~ 70,0 MHz 3,579 ~ 70,0 MHz ±10 … ±50ppm ±10 … ±50ppm ±10 … ±50ppm ±10 … ±50ppm ±10 … ±50ppm ±10 … ±50ppm ±10 … ±50ppm ±10 … ±50ppm ±10 … ±50ppm ±50ppm ±10 … ±50ppm ±10 … ±50ppm (*) -40°C …+85°C (*) -40°C …+125°C (*) -40°C …+125°C (*) -40°C …+125°C (*) -40°C …+105°C (*) -40°C …+105°C (*) -40°C …+125°C (*) -40°C …+105°C (*) -40°C …+105°C (*) -40°C …+105°C (*) -40°C …+85°C (*) -40°C …+85°C 8, 8…16 8, 8…16 10, 8…16 12, 7…20 16, 10…20 16, 10…20 16, 10…20 16, 12…20 16, 12…20 16, 12…20 16, 12…30 16, 12…30 - yes yes yes - - - - - - - - KX-4.pdf <http://www.geyer-electronic.de/uploads/tx_userartikelfrequenz/GEYER-KX-4.pdf> KX-5.pdf <http://www.geyer-electronic.de/uploads/tx_userartikelfrequenz/GEYER-KX-5.pdf> KX-6.pdf <http://www.geyer-electronic.de/uploads/tx_userartikelfrequenz/GEYER-KX-6.pdf> KX-7.pdf <http://www.geyer-electronic.de/uploads/tx_userartikelfrequenz/GEYER-KX-7.pdf> KX-9A.pdf <http://www.geyer-electronic.de/uploads/tx_userartikelfrequenz/GEYER-KX-9A.pdf> KX-9B.pdf <http://www.geyer-electronic.de/uploads/tx_userartikelfrequenz/GEYER-KX-9B.pdf> KX-12A.pdf <http://www.geyer-electronic.de/uploads/tx_userartikelfrequenz/GEYER-KX-12A.pdf> KX-12B.pdf <http://www.geyer-electronic.de/uploads/tx_userartikelfrequenz/GEYER-KX-12B.pdf> KX-13.pdf <http://www.geyer-electronic.de/uploads/tx_userartikelfrequenz/GEYER-KX-13.pdf> KX-20.pdf <http://www.geyer-electronic.de/uploads/tx_userartikelfrequenz/GEYER-KX-20.pdf> KX-K.pdf <http://www.geyer-electronic.de/uploads/tx_userartikelfrequenz/GEYER-KX-K.pdf> KX-KS.pdf <http://www.geyer-electronic.de/uploads/tx_userartikelfrequenz/GEYER-KX-KS.pdf> <http://www.geyer-electronic.de/fileadmin/template/img/logo-geyer-electronic.png> Details see: http://www.geyer-electronic.de/Frequenz-Produkte.9.0.html Created 2016-06-07, Hans Locher 2016 (C) Geyer Quartz Technology KX4,KX5,KX6,KX7,KX9A,KX9B,KX12A,KX12B,KX13,KX20,KXK,KXKS;1612;2016;2520;3225;5032;6035;7050;11655;12345;1,6x1,2;2,0x1,6;2,5x2,0;3,2x2,5;5,0x3,2;6,0x3,5;7,0x5,0;11,6x5,5;12,3x4,5;12,3x4,5;1.6x1.2;2.0x1.6;2.5x2.0;3.2x2.5;5.0x3.2;6.0x3.5;7.0x5.0;11.6x5.5;12.3x4.5;12.3x4.5;
Q2 = semicon-smd-ipc:PNP-TRANSISTOR_: PNP TRANSISTOR
Q3 = crystal-geyer_V1_0:KX: Quartz Crystals (MHz) SMD: KX - Serie Model Size l/w/h [mm] Frequency Range Frequency Stability Temp. Range [°C] Load Capacitance AECQ 200 availabel Datasheet KX-4 KX-5 KX-6 KX-7 KX-9A KX-9B KX-12A KX-12B KX-13 KX-20 KX-K KX-KS 1.6/1.2/0.3 2.0/1.6/0.45 2.5/2.0/0.55 3.2/2.5/0.8 5.0/3.2/1.0 5.0/3.2/1.1 6.0/3.5/1.1 6.0/3.5/1.0 7.0/5.0 /1.3 11.6/5.5/1.6 12.3/4.5/4.2 12.3/4.5/3.2 24.0 ~ 80.0 MHz 16.0 ~ 80.0 MHz 12.0 ~ 80.0 MHz 8.0 ~ 60.0 MHz 7,68 ~ 300,0 MHz 8,0 ~ 50,0 MHz 8,0 ~ 150,0 MHz 8,0 ~ 50,0 MHz 6,0 ~ 160,0 MHz 3,579 ~ 25,0 MHz 3,579 ~ 70,0 MHz 3,579 ~ 70,0 MHz ±10 … ±50ppm ±10 … ±50ppm ±10 … ±50ppm ±10 … ±50ppm ±10 … ±50ppm ±10 … ±50ppm ±10 … ±50ppm ±10 … ±50ppm ±10 … ±50ppm ±50ppm ±10 … ±50ppm ±10 … ±50ppm (*) -40°C …+85°C (*) -40°C …+125°C (*) -40°C …+125°C (*) -40°C …+125°C (*) -40°C …+105°C (*) -40°C …+105°C (*) -40°C …+125°C (*) -40°C …+105°C (*) -40°C …+105°C (*) -40°C …+105°C (*) -40°C …+85°C (*) -40°C …+85°C 8, 8…16 8, 8…16 10, 8…16 12, 7…20 16, 10…20 16, 10…20 16, 10…20 16, 12…20 16, 12…20 16, 12…20 16, 12…30 16, 12…30 - yes yes yes - - - - - - - - KX-4.pdf <http://www.geyer-electronic.de/uploads/tx_userartikelfrequenz/GEYER-KX-4.pdf> KX-5.pdf <http://www.geyer-electronic.de/uploads/tx_userartikelfrequenz/GEYER-KX-5.pdf> KX-6.pdf <http://www.geyer-electronic.de/uploads/tx_userartikelfrequenz/GEYER-KX-6.pdf> KX-7.pdf <http://www.geyer-electronic.de/uploads/tx_userartikelfrequenz/GEYER-KX-7.pdf> KX-9A.pdf <http://www.geyer-electronic.de/uploads/tx_userartikelfrequenz/GEYER-KX-9A.pdf> KX-9B.pdf <http://www.geyer-electronic.de/uploads/tx_userartikelfrequenz/GEYER-KX-9B.pdf> KX-12A.pdf <http://www.geyer-electronic.de/uploads/tx_userartikelfrequenz/GEYER-KX-12A.pdf> KX-12B.pdf <http://www.geyer-electronic.de/uploads/tx_userartikelfrequenz/GEYER-KX-12B.pdf> KX-13.pdf <http://www.geyer-electronic.de/uploads/tx_userartikelfrequenz/GEYER-KX-13.pdf> KX-20.pdf <http://www.geyer-electronic.de/uploads/tx_userartikelfrequenz/GEYER-KX-20.pdf> KX-K.pdf <http://www.geyer-electronic.de/uploads/tx_userartikelfrequenz/GEYER-KX-K.pdf> KX-KS.pdf <http://www.geyer-electronic.de/uploads/tx_userartikelfrequenz/GEYER-KX-KS.pdf> <http://www.geyer-electronic.de/fileadmin/template/img/logo-geyer-electronic.png> Details see: http://www.geyer-electronic.de/Frequenz-Produkte.9.0.html Created 2016-06-07, Hans Locher 2016 (C) Geyer Quartz Technology KX4,KX5,KX6,KX7,KX9A,KX9B,KX12A,KX12B,KX13,KX20,KXK,KXKS;1612;2016;2520;3225;5032;6035;7050;11655;12345;1,6x1,2;2,0x1,6;2,5x2,0;3,2x2,5;5,0x3,2;6,0x3,5;7,0x5,0;11,6x5,5;12,3x4,5;12,3x4,5;1.6x1.2;2.0x1.6;2.5x2.0;3.2x2.5;5.0x3.2;6.0x3.5;7.0x5.0;11.6x5.5;12.3x4.5;12.3x4.5;
Q4 = crystal-geyer_V1_0:KX-327: Tuning Fork Crystals (kHz) SMD: KX327 - Serie Model Size l/w/h [mm] Frequency Range Frequency Stability Temp. Range [°C] Load Capacitance AECQ 200 availabel Datasheet KX-327VT KX-327FT KX-327RT KX-327NHT KX-327NHF KX-327L KX-327S 1.25/1.05/0.5 1.6/1.0/0.5 2.0/1.2/0.6 3.2/1.5/0.8 3.2/1.5/0.8 7.0/1.5/1.4 8.2/3.8/2.5 32,768 kHz 32,768 kHz 32,768 kHz 32,768 kHz 32,768 kHz 32,768 kHz 32,768 kHz ±10 … ±20ppm ±10 … ±20ppm ±10 … ±20ppm ±10 … ±20ppm ±10 … ±20ppm ±10 … ±20ppm ±5 … ±20ppm (*) -40°C …+85°C (*) -40°C …+85°C (*) -40°C …+85°C (*) -40°C …+85°C (*) -40°C …+125°C (*) -40°C …+85°C (*) -40°C …+85°C 7/9/12,5 7/9/12,5 7/9/12,6 7/9/12,5 9/12,5 7/9/12,5 6/12,5 - - - - yes - - KX-327VT.pdf <http://www.geyer-electronic.de/uploads/tx_userartikelfrequenz/GEYER-KX-327VT.pdf> KX-327FT.pdf <http://www.geyer-electronic.de/uploads/tx_userartikelfrequenz/GEYER-KX-327FT.pdf> KX-327RT.pdf <http://www.geyer-electronic.de/uploads/tx_userartikelfrequenz/GEYER-KX-327RT.pdf> KX-327NHT.pdf <http://www.geyer-electronic.de/uploads/tx_userartikelfrequenz/GEYER-KX-327NHT.pdf> KX-327NHF.pdf <http://www.geyer-electronic.de/uploads/tx_userartikelfrequenz/GEYER-KX-327NHF.pdf> KX-327L.pdf <http://www.geyer-electronic.de/uploads/tx_userartikelfrequenz/GEYER-KX-327L.pdf> KX-327S.pdf <http://www.geyer-electronic.de/uploads/tx_userartikelfrequenz/GEYER-KX-327S.pdf> <http://www.geyer-electronic.de/fileadmin/template/img/logo-geyer-electronic.png> Details see: http://www.geyer-electronic.de/Frequenz-Produkte.9.0.html Created 2016-06-07, Hans Locher 2016 (C) Geyer Quartz Technology KX327VT,KX327FT,KX327RT,KX327NHT,KX327NHF,KX327S,KX327L;125105;1610;2012;3215;7015;8238;1,25x1,05,1.25x1.05;1,6x1,0,1.6x1.0;2,0x1,2,2.0x1.2;3,2x1,5,3.2x1.5;8,2x3,8,8.2x3.8,7.0x1.5,7,0x1,532.768kHz
R1-R138 = rcl:R-EU_: RESISTOR, European symbol; SPICEPREFIX: R
RN1 RN2 = resistor-dil:4R-N: Array Chip Resistor Source: RS Component / Phycomp; OC_FARNELL: unknown; OC_NEWARK: unknown
S2 = switch-tact2:DTSM-3
U1 = MF_Discrete_Semiconductor:NPN_BJT: Library: MF_Discrete_Semiconductor Description: Device for Single NPN BJT Transistors. Manufacture part number (MFG#) can be added via Attributes.; HOUSEPART: YES; MPN: MF-DSC-SOT233-MMBT5551; POPULATE: 1; URL: https://factory.macrofab.com/part/MF-DSC-SOT233-MMBT3904; VALUE: MF-DSC-SOT233-MMBT3904
U2 = W5500:W5500
U3-U30 = MF_Discrete_Semiconductor:NPN_BJT: Library: MF_Discrete_Semiconductor Description: Device for Single NPN BJT Transistors. Manufacture part number (MFG#) can be added via Attributes.; HOUSEPART: YES; MPN: MF-DSC-SOT233-MMBT3904; POPULATE: 1; URL: https://factory.macrofab.com/part/MF-DSC-SOT233-MMBT3904; VALUE: MF-DSC-SOT233-MMBT3904
U$1 = ch340g:CH340G
U$2 = diy-modules:DC-DC-STEP-DOWN-MP1584: DC/DC Step-Down Regulator based on MP1584 chip MP1584 datasheet available here: http://www.haoyuelectronics.com/Attachment/MP1584/MP1584.pdf Click here to find device on ebay.com <http://www.ebay.com/sch/mp1584+module>
X1 X7 X8 = Rembrandt:TERMINAL-BLOCK-3.5MM-8-PIN: Terminal Block 3.5mm Pitch: 3,5 mm Number of pins: 8 Created by Rembrandt Electronics www.rembrandtelectronics.com
X2 = Rembrandt:TERMINAL-BLOCK-3.5MM-9-PIN: Terminal Block 3.5mm Pitch: 3,5 mm Number of pins: 9 Created by Rembrandt Electronics www.rembrandtelectronics.com
X4 X5 = Rembrandt:TERMINAL-BLOCK-3.5MM-4-PIN: Terminal Block 3.5mm Pitch: 3,5 mm Number of pins: 4 Created by Rembrandt Electronics www.rembrandtelectronics.com